# EAGLE board PCB_KioskMB_r3.2 (EAGLE 8.2.1), part 1 of 3
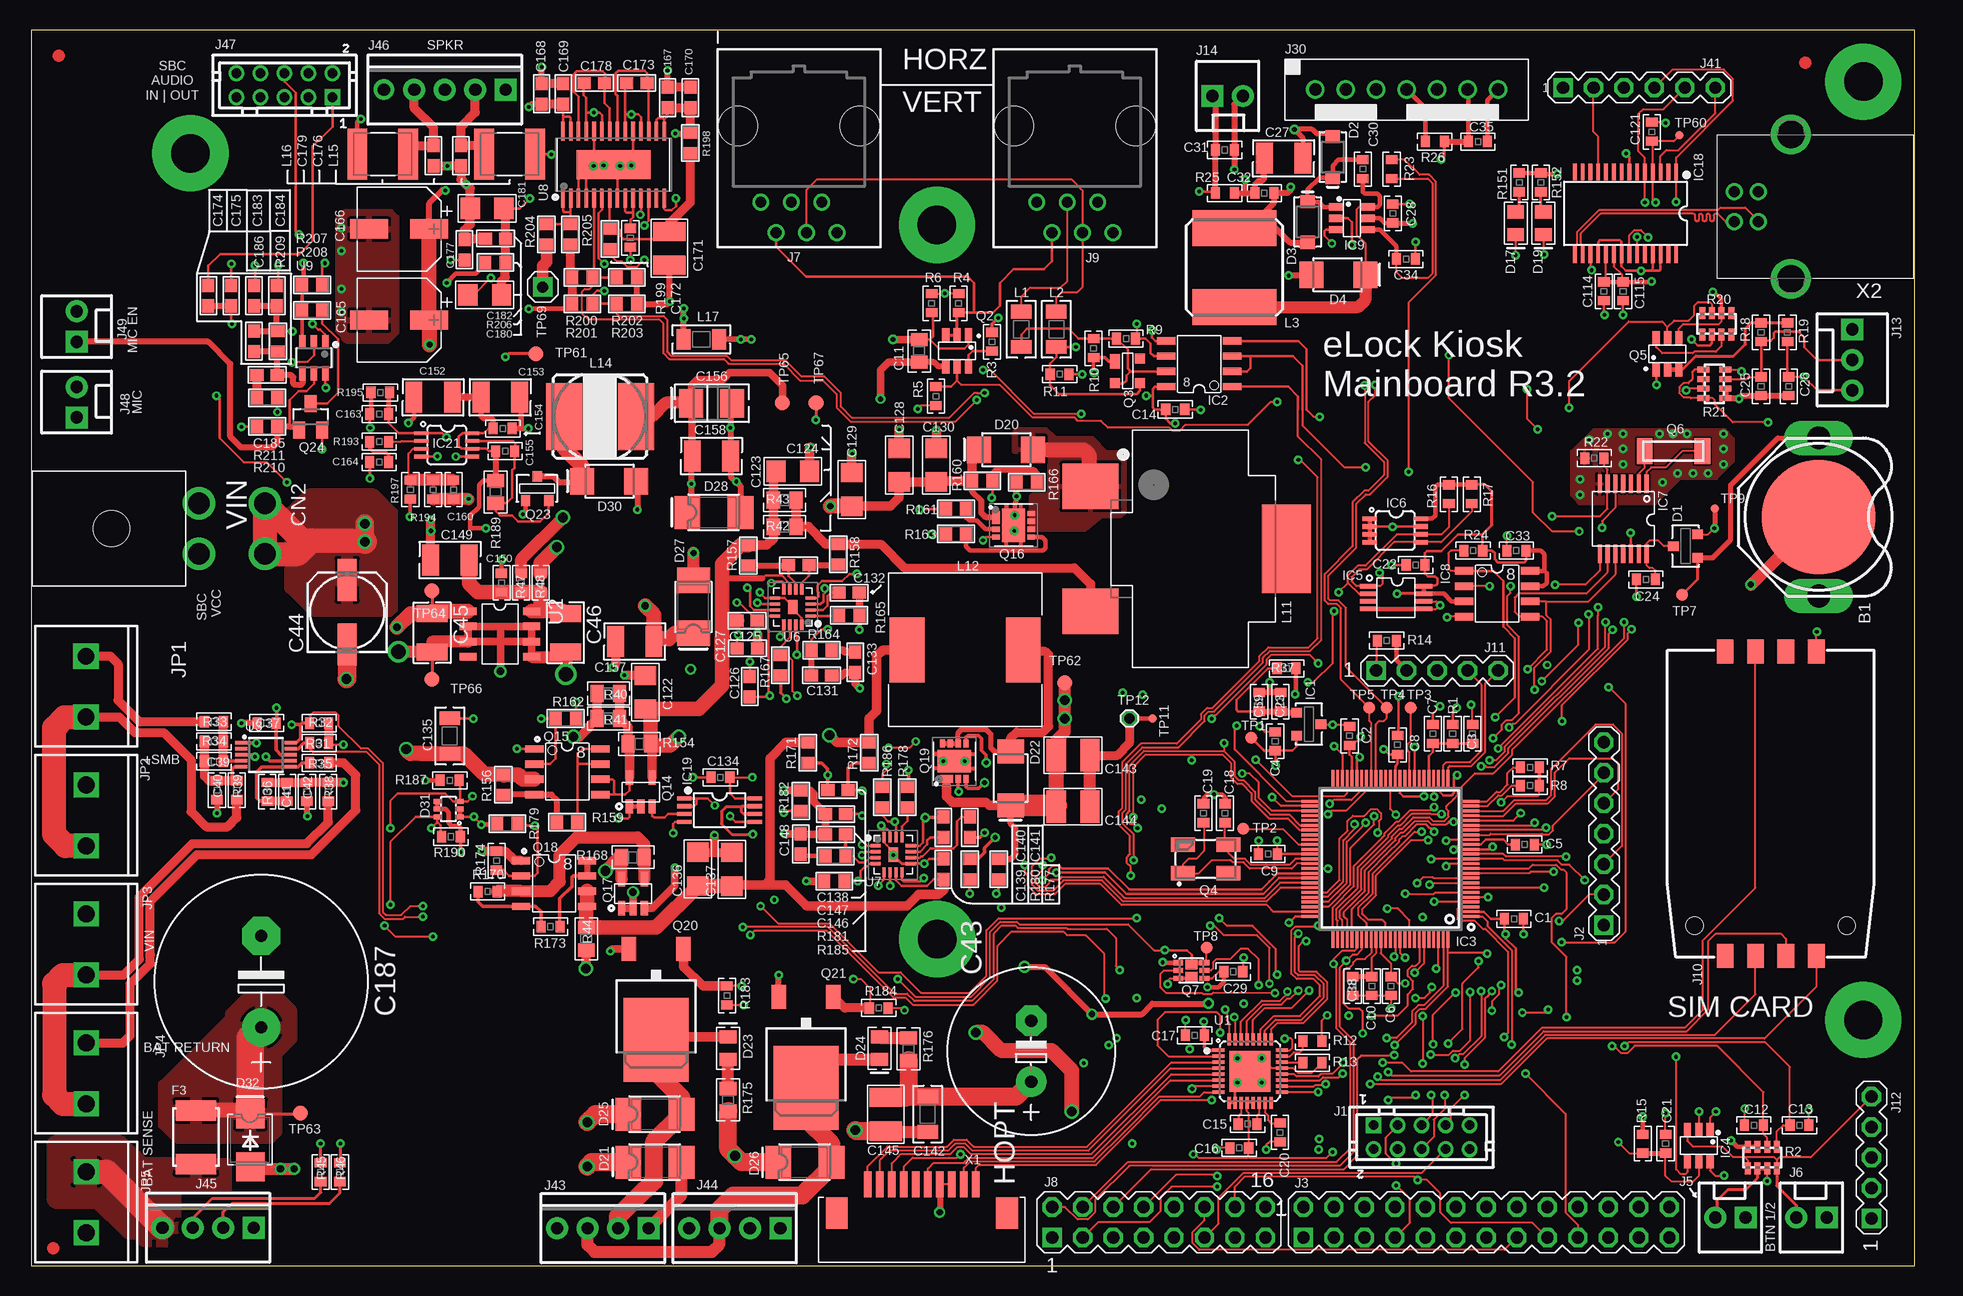
[diagram p11: board, top side]
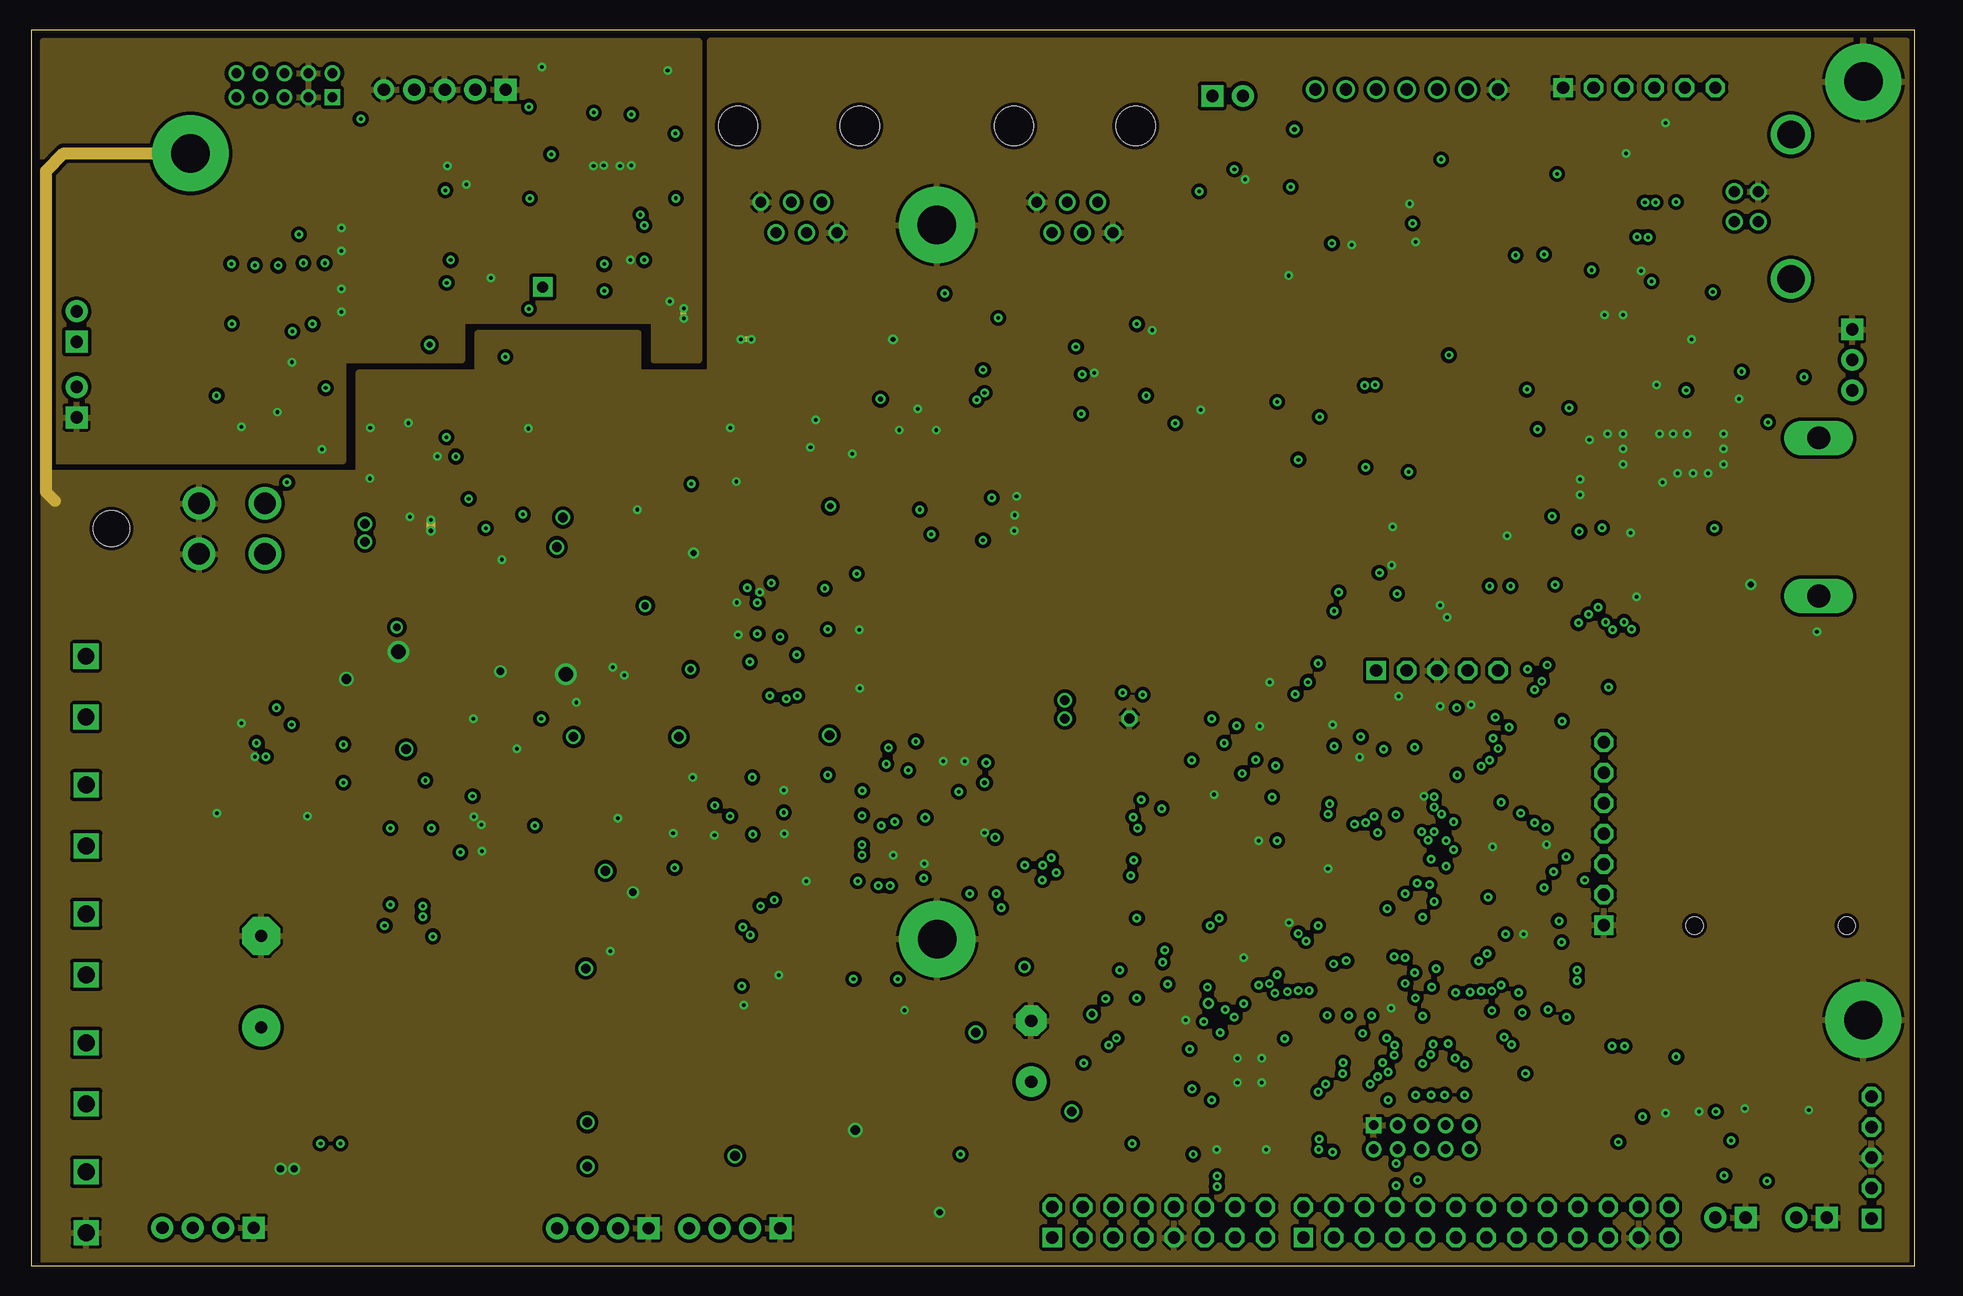
[diagram p12: board, inner layer DGND]
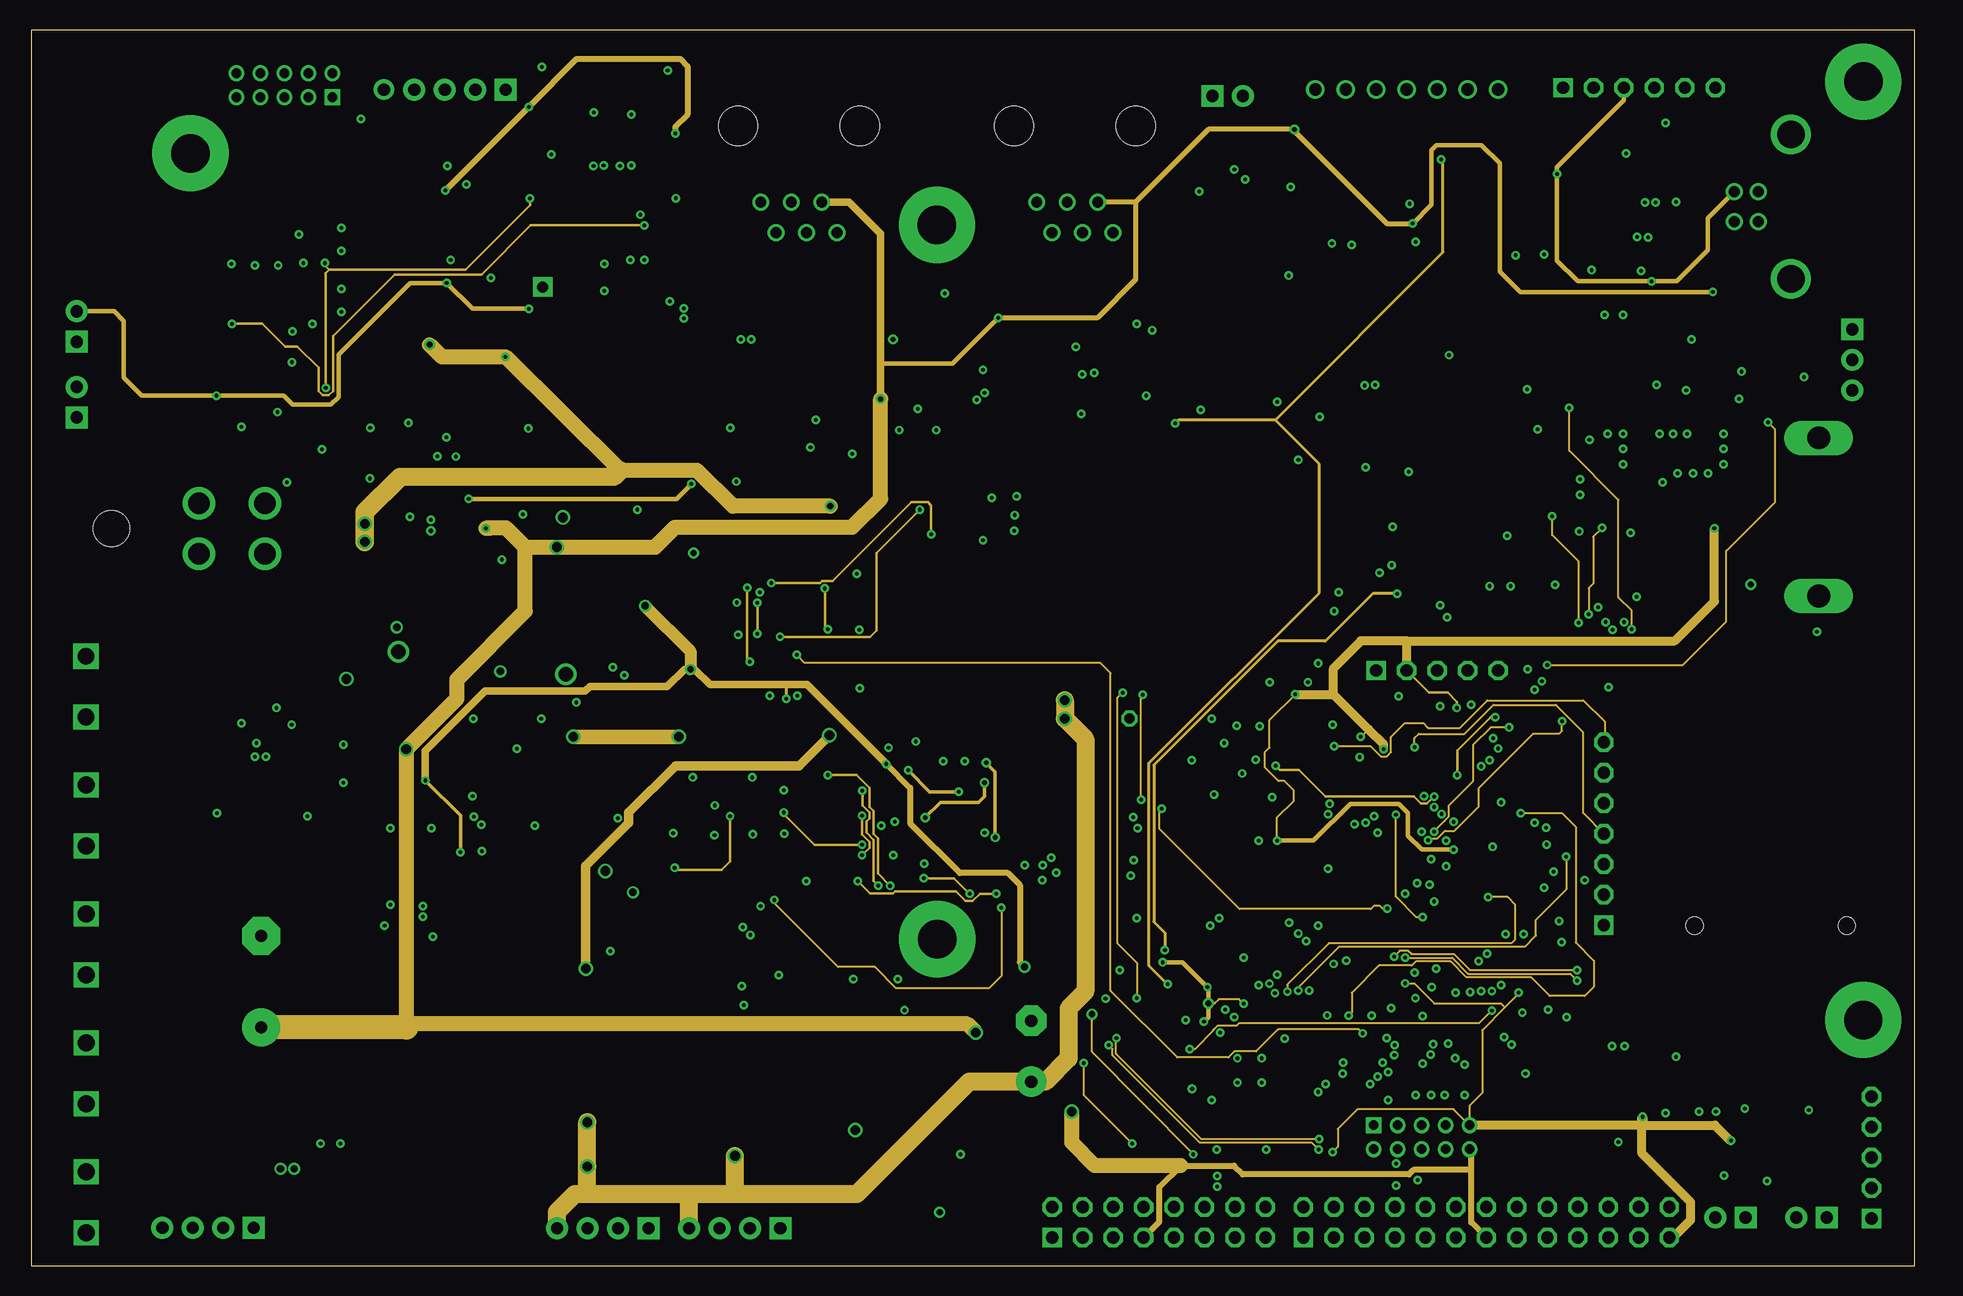
[diagram p13: board, inner layer SUPPLY]
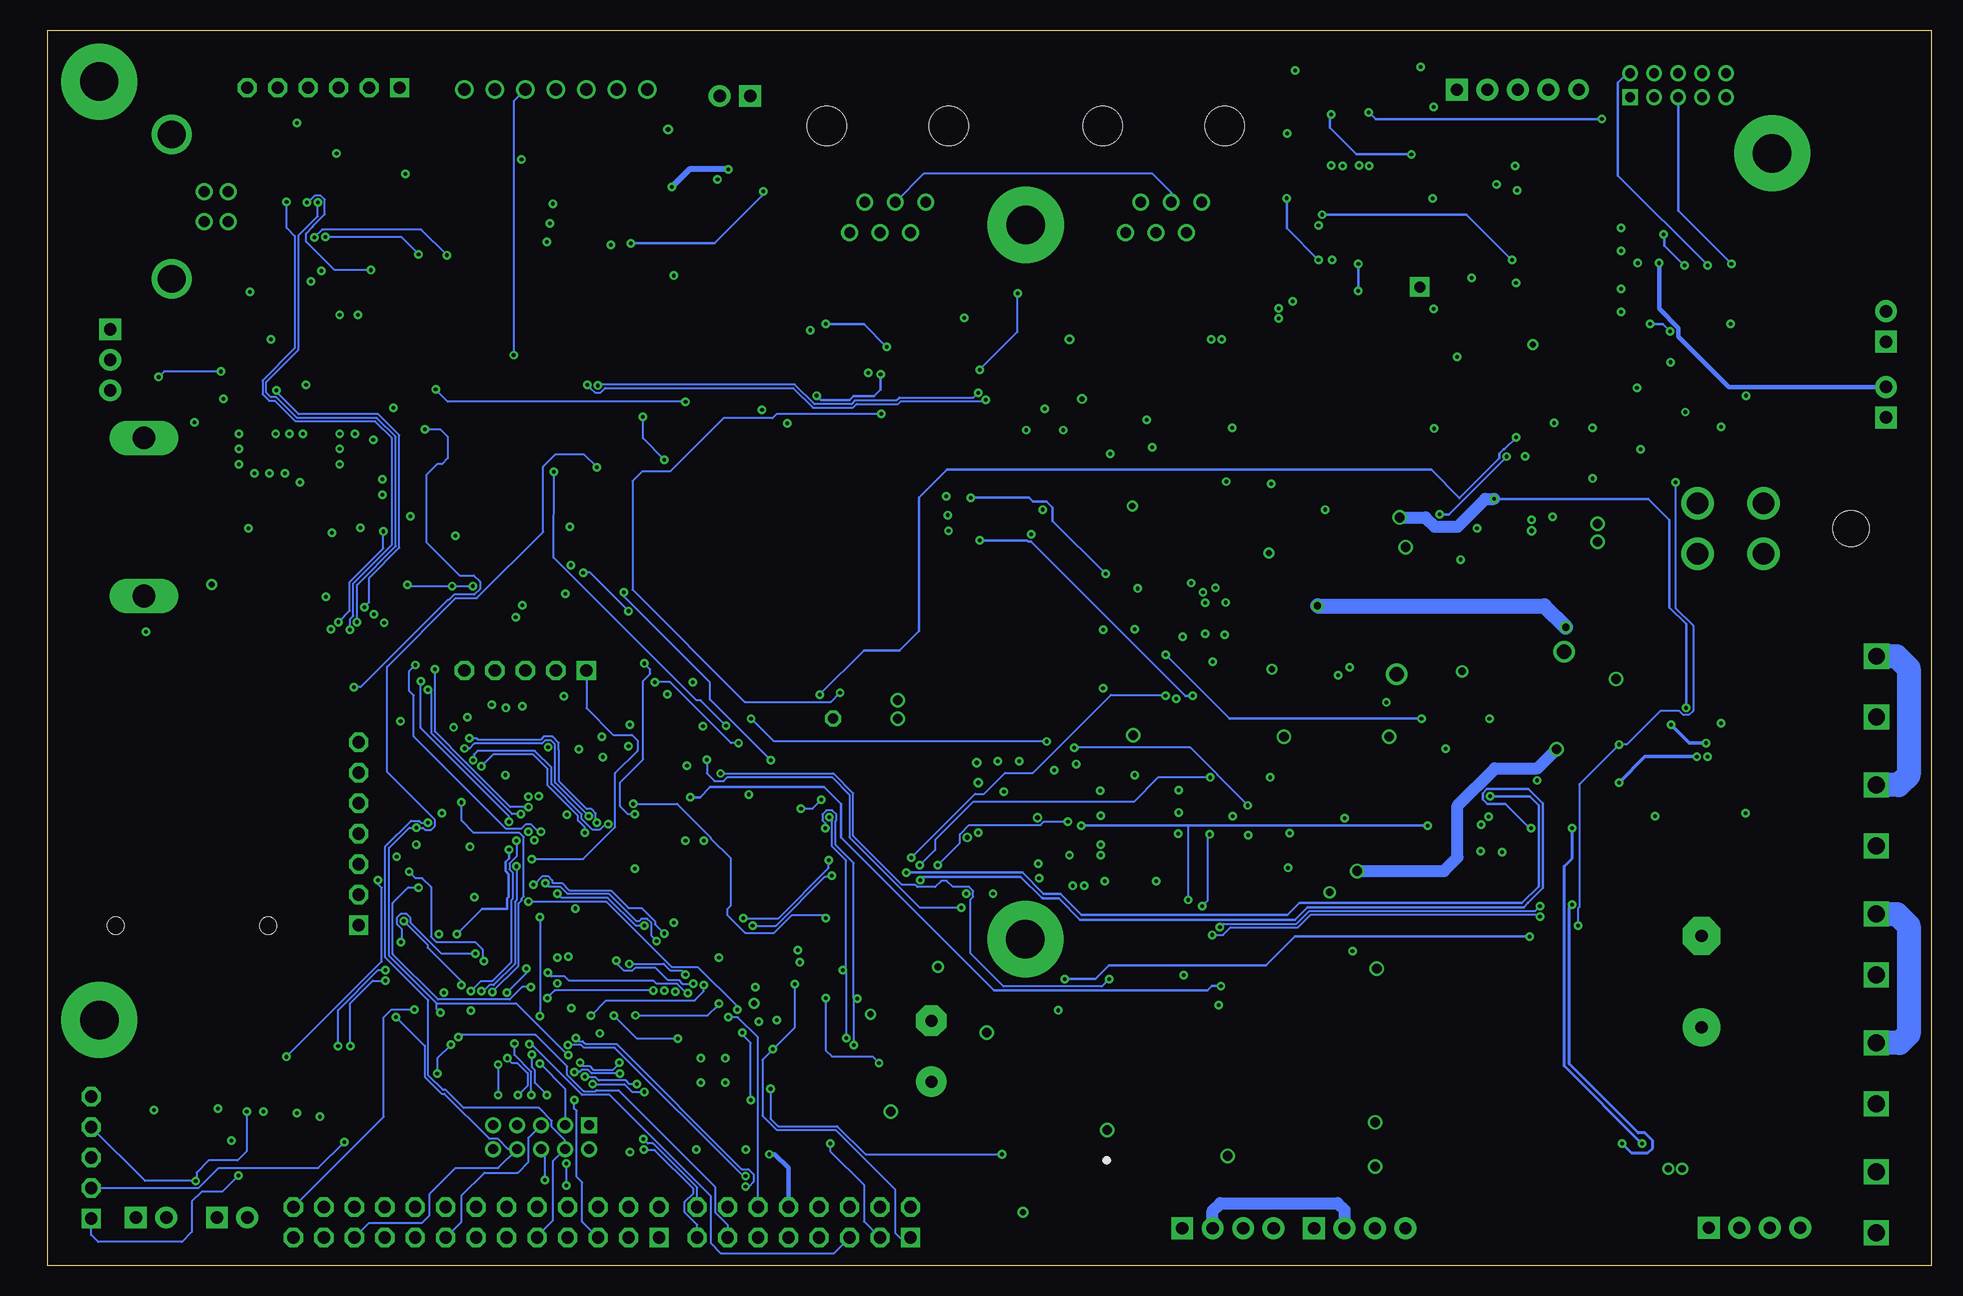
[diagram p14: board, bottom side, seen from below]

Size 157 x 103 mm. Coordinates in mm from the lower left corner, seen from the top.
Outline: 157,103 0,103 0,0 157,0 157,103
Copper layers (1*2*15*16): Top 0.035mm / dielectric 0.33mm / DGND 0.035mm / dielectric 0.8mm / SUPPLY 0.035mm / dielectric 0.33mm / Bottom 0.035mm
Design rules "alleybeachdrc4layer *": minimum track width 6mil, minimum drill 0.3mm, track to track 6mil, track to pad 6mil, pad to pad 6mil, via to via 6mil, smd to smd 6mil, copper to edge 10mil, drill to drill 10mil, minimum pad ring 10mil, minimum via ring 8mil, stop-mask expansion 5mil, vias tented up to drill 0.3mm, thermal gap 10mil

## Footprints (pad centres in the part's own frame; a part is rotated, then mirrored left to right if it is on the bottom)
3001 = drill 1.905 pad 2.413 long: + -6.6,0; +2 6.6,0 | smd 9.5 x 9.5: - 0,0
0603 = smd 0.762 x 0.965: 1 -0.787,0; 2 0.787,0
0805 = smd 1.092 x 1.397: 1 -0.94,0; 2 0.94,0
1210 = smd 1.397 x 2.591: 1 -1.6,0; 2 1.6,0
E5-13 = drill 1.016 pad 2.54: + -2.54,0 | drill 1.016 pad 2.54 octagon: - 2.54,0
153CLV-0605 = smd 3.5 x 1.6: + 2.7,0; - -2.7,0
C1206 = smd 1.6 x 1.8: 1 -1.4,0; 2 1.4,0
C0603 = smd 1.1 x 1: 1 -0.85,0; 2 0.85,0
1206 = smd 1.143 x 1.702: 1 -1.473,0; 2 1.473,0
C1210 = smd 1.6 x 2.7: 1 -1.4,0; 2 1.4,0
3528-POL = smd 2.007 x 2.388: 1 -1.702,0; 2 1.702,0
CAP_6.3MM_DIA_SMT = smd 1.6 x 3.2: 1 0,2.5; 2 0,-2.5
E7,5-18 = drill 1.016 pad 3.15: + -3.81,0 | drill 1.016 pad 3.15 octagon: - 3.81,0
0039301040 = drill 1.8: 1 -2.1,0; 2 2.1,0; 3 -2.1,5.5; 4 2.1,5.5 | hole 3: 0,-7.3
SOT-23 = smd 0.787 x 0.889: 1 0.991,1.016; 2 -0.94,1.016; 3 0.025,-1.016
SOD-123 = smd 1.1 x 1.2: A 1.7,0; C -1.7,0
SOD-128 = smd 2 x 2.2: A 2.2,0; K -2.3,0
0805-POL = smd 1.092 x 1.397: 1+ -0.94,0; 2 0.94,0
SMA = smd 2.159 x 2.743: + -2.311,0.003; - 2.108,-0.002
SMA' = smd 2.159 x 2.743: A 2.108,-0.002; C -2.311,0.003
SOT-363 = smd 0.42 x 0.6: 1 -0.65,-0.95; 2 0,-0.95; 3 0.65,-0.95; 4 0.65,0.95; 5 0,0.95; 6 -0.65,0.95
SMB = smd 2.4 x 2.4: A 2.2,0; C -2.2,0
1812 = smd 1.702 x 3.4: 1 -2.235,0; 2 2.235,0
STANDOFF-ELECTRICAL = drill 3.2 pad 6.35: P1 0,0
SO08 = smd 0.61 x 1.524: 1 -1.905,-2.743; 2 -0.635,-2.743; 3 0.635,-2.743; 4 1.905,-2.743; 5 1.905,2.743; 6 0.635,2.743; 7 -0.635,2.743; 8 -1.905,2.743
SQFP-S-12X12-100 = smd 0.24 x 1.6: 1 -4.8,-6.6; 2 -4.4,-6.6; 3 -4,-6.6; 4 -3.6,-6.6; 5 -3.2,-6.6; 6 -2.8,-6.6; 7 -2.4,-6.6; 8 -2,-6.6; 9 -1.6,-6.6; 10 -1.2,-6.6; 11 -0.8,-6.6; 12 -0.4,-6.6; 13 0,-6.6; 14 0.4,-6.6; 15 0.8,-6.6; 16 1.2,-6.6; 17 1.6,-6.6; 18 2,-6.6; 19 2.4,-6.6; 20 2.8,-6.6; 21 3.2,-6.6; 22 3.6,-6.6; 23 4,-6.6; 24 4.4,-6.6; 25 4.8,-6.6; 51 4.8,6.6; 52 4.4,6.6; 53 4,6.6; 54 3.6,6.6; 55 3.2,6.6; 56 2.8,6.6; 57 2.4,6.6; 58 2,6.6; 59 1.6,6.6; 60 1.2,6.6; 61 0.8,6.6; 62 0.4,6.6; 63 0,6.6; 64 -0.4,6.6; 65 -0.8,6.6; 66 -1.2,6.6; 67 -1.6,6.6; 68 -2,6.6; 69 -2.4,6.6; 70 -2.8,6.6; 71 -3.2,6.6; 72 -3.6,6.6; 73 -4,6.6; 74 -4.4,6.6; 75 -4.8,6.6 | smd 1.6 x 0.24: 26 6.6,-4.8; 27 6.6,-4.4; 28 6.6,-4; 29 6.6,-3.6; 30 6.6,-3.2; 31 6.6,-2.8; 32 6.6,-2.4; 33 6.6,-2; 34 6.6,-1.6; 35 6.6,-1.2; 36 6.6,-0.8; 37 6.6,-0.4; 38 6.6,0; 39 6.6,0.4; 40 6.6,0.8; 41 6.6,1.2; 42 6.6,1.6; 43 6.6,2; 44 6.6,2.4; 45 6.6,2.8; 46 6.6,3.2; 47 6.6,3.6; 48 6.6,4; 49 6.6,4.4; 50 6.6,4.8; 76 -6.6,4.8; 77 -6.6,4.4; 78 -6.6,4; 79 -6.6,3.6; 80 -6.6,3.2; 81 -6.6,2.8; 82 -6.6,2.4; 83 -6.6,2; 84 -6.6,1.6; 85 -6.6,1.2; 86 -6.6,0.8; 87 -6.6,0.4; 88 -6.6,0; 89 -6.6,-0.4; 90 -6.6,-0.8; 91 -6.6,-1.2; 92 -6.6,-1.6; 93 -6.6,-2; 94 -6.6,-2.4; 95 -6.6,-2.8; 96 -6.6,-3.2; 97 -6.6,-3.6; 98 -6.6,-4; 99 -6.6,-4.4; 100 -6.6,-4.8
SOT23-6 = smd 0.6 x 1.2: 1 -0.95,-1.306; 2 0,-1.306; 3 0.95,-1.306; 4 0.95,1.306; 5 0.003,1.306; 6 -0.95,1.306
TSSOP08-3 = smd 0.38 x 1.4: 1 -0.94,-2.343; 2 -0.305,-2.343; 3 0.33,-2.343; 4 0.965,-2.343; 5 0.965,2.292; 6 0.33,2.292; 7 -0.305,2.292; 8 -0.94,2.292
MSOP-08 = smd 0.38 x 1.2: 1 -1.008,-2.18; 2 -0.358,-2.18; 3 0.292,-2.18; 4 0.942,-2.18; 5 0.942,2.045; 6 0.292,2.045; 7 -0.358,2.045; 8 -1.008,2.045
TSSOP014 = smd 0.356 x 1.524: 1 -1.95,-2.873; 2 -1.305,-2.873; 3 -0.65,-2.873; 4 -0.005,-2.873; 5 0.65,-2.873; 6 1.295,-2.873; 7 1.95,-2.873; 8 1.95,2.962; 9 1.295,2.962; 10 0.65,2.962; 11 -0.005,2.962; 12 -0.65,2.962; 13 -1.305,2.962; 14 -1.95,2.962
SO-08 = smd 0.61 x 1.524: 1 -1.905,-2.743; 2 -0.635,-2.743; 3 0.635,-2.743; 4 1.905,-2.743; 5 1.905,2.743; 6 0.635,2.743; 7 -0.635,2.743; 8 -1.905,2.743
SSOP28DB = smd 0.32 x 1.4: 1 -4.225,-3.45; 2 -3.575,-3.45; 3 -2.925,-3.45; 4 -2.275,-3.45; 5 -1.625,-3.45; 6 -0.975,-3.45; 7 -0.325,-3.45; 8 0.325,-3.45; 9 0.975,-3.45; 10 1.625,-3.45; 11 2.275,-3.45; 12 2.925,-3.45; 13 3.575,-3.45; 14 4.225,-3.45; 15 4.225,3.45; 16 3.575,3.45; 17 2.925,3.45; 18 2.275,3.45; 19 1.625,3.45; 20 0.975,3.45; 21 0.325,3.45; 22 -0.325,3.45; 23 -0.975,3.45; 24 -1.625,3.45; 25 -2.275,3.45; 26 -2.925,3.45; 27 -3.575,3.45; 28 -4.225,3.45
TSSOP8 = smd 0.35 x 1.2: 1 -0.975,-2.925; 2 -0.325,-2.925; 3 0.325,-2.925; 4 0.975,-2.925; 5 0.975,2.925; 6 0.325,2.925; 7 -0.325,2.925; 8 -0.975,2.925
MSOP-08' = smd 0.3 x 1.2: 1 -1.008,-2.18; 2 -0.358,-2.18; 3 0.292,-2.18; 4 0.942,-2.18; 5 0.942,2.045; 6 0.292,2.045; 7 -0.358,2.045; 8 -1.008,2.045
DF11-10DP-2DSA = drill 0.813 pad 1.321 square: 1 4,-1 | drill 0.813 pad 1.321: 2 4,1; 3 2,-1; 4 2,1; 5 0,-1; 6 0,1; 7 -2,-1; 8 -2,1; 9 -4,-1; 10 -4,1
MA07-1 = drill 1.016 pad 1.6 square: 1 -7.62,0 | drill 1.016 pad 1.6 octagon: 2 -5.08,0; 3 -2.54,0; 4 0,0; 5 2.54,0; 6 5.08,0; 7 7.62,0
MA13-2 = drill 1.016 pad 1.6 square: 1 -15.24,-1.27 | drill 1.016 pad 1.6 octagon: 2 -15.24,1.27; 3 -12.7,-1.27; 4 -12.7,1.27; 5 -10.16,-1.27; 6 -10.16,1.27; 7 -7.62,-1.27; 8 -7.62,1.27; 9 -5.08,-1.27; 10 -5.08,1.27; 11 -2.54,-1.27; 12 -2.54,1.27; 13 0,-1.27; 14 0,1.27; 15 2.54,-1.27; 16 2.54,1.27; 17 5.08,-1.27; 18 5.08,1.27; 19 7.62,-1.27; 20 7.62,1.27; 21 10.16,-1.27; 22 10.16,1.27; 23 12.7,-1.27; 24 12.7,1.27; 25 15.24,-1.27; 26 15.24,1.27
3-641215-2 = drill 1.016 pad 1.829 square: 1 2.54,0 | drill 1.016 pad 1.829: 2 0,0
SS-6566-NF = drill 0.889: 1 -3.175,8.89; 2 -1.905,6.35; 3 -0.635,8.89; 4 0.635,6.35; 5 1.905,8.89; 6 3.175,6.35 | hole 3.251: 5.08,0; -5.08,0
MA08-2 = drill 1.016 pad 1.6 square: 1 -8.89,-1.27 | drill 1.016 pad 1.6 octagon: 2 -8.89,1.27; 3 -6.35,-1.27; 4 -6.35,1.27; 5 -3.81,-1.27; 6 -3.81,1.27; 7 -1.27,-1.27; 8 -1.27,1.27; 9 1.27,-1.27; 10 1.27,1.27; 11 3.81,-1.27; 12 3.81,1.27; 13 6.35,-1.27; 14 6.35,1.27; 15 8.89,-1.27; 16 8.89,1.27
CCM03-3504LFT-NR = smd 2 x 1.4: C1 12.7,3.81; C2 12.7,1.27; C3 12.7,-1.27; C4 12.7,-3.81; C5 -12.7,3.81; C6 -12.7,1.27; C7 -12.7,-1.27; C8 -12.7,-3.81 | hole 1.422: 10.16,6.35; 10.16,-6.35
MA05-1 = drill 1.016 pad 1.6 square: 1 -5.08,0 | drill 1.016 pad 1.6 octagon: 2 -2.54,0; 3 0,0; 4 2.54,0; 5 5.08,0
3-641215-3 = drill 1.016 pad 1.829 square: 1 2.54,0 | drill 1.016 pad 1.829: 2 0,0; 3 -2.54,0
HRXL-MAXSONAR-WRC-MB7387 = drill 1.016: 1 2.54,2.54; 2 5.08,2.54; 3 7.62,2.54; 4 10.16,2.54; 5 12.7,2.54; 6 15.24,2.54; 7 17.78,2.54
MA06-1 = drill 1.016 pad 1.6 square: 1 -6.35,0 | drill 1.016 pad 1.6 octagon: 2 -3.81,0; 3 -1.27,0; 4 1.27,0; 5 3.81,0; 6 6.35,0
3-641215-4 = drill 1.016 pad 1.829 square: 1 3.81,0 | drill 1.016 pad 1.829: 2 1.27,0; 3 -1.27,0; 4 -3.81,0
3-641215-5 = drill 1.016 pad 1.829 square: 1 5.08,0 | drill 1.016 pad 1.829: 2 2.54,0; 3 0,0; 4 -2.54,0 | drill 1.016 pad 1.702: 5 -5.08,0
1X02_2.54_SCREWTERM = drill 1.4 square: P1 5.08,0; P2 0,0
NRS8030 = smd 7 x 3: 1 0,-3.3; 2 0,3.3
L_SER20XX = smd 3.81 x 4.699: 1 -5.207,-8.319; 2 5.207,-8.319 | smd 7.366 x 4.064: 3 0,8.001
L_SRR1280 = smd 5.4 x 2.9: 1 0,4.85; 2 0,-4.85
CR75 = smd 5.6 x 3: 1 0,-3; 2 0,3
L1812 = smd 1.66 x 4.22: 1 -2.12,0; 2 2.12,0
SSOT-6 = smd 0.6 x 1.2: 1 -0.95,-1.306; 2 0,-1.306; 3 0.95,-1.306; 4 0.95,1.306; 5 0.003,1.306; 6 -0.95,1.306
SOT-143 = smd 1.194 x 0.838: 1 -0.813,-1.041 | smd 0.838 x 0.838: 2 0.991,-1.041; 3 0.991,1.041; 4 -1.016,1.041
7B = smd 2 x 1.2: 1 -1.9,-1.2; 2 1.9,-1.2; 3 1.9,1.2; 4 -1.9,1.2
CM519 = smd 1.3 x 2.2: 1 -2.4,0; 2 2.4,0
MICRO_FET = smd 0.42 x 0.8: 1 -0.65,-1.1; 2 0,-1.1; 3 0.65,-1.1; 4 0.65,1.1; 5 0,1.1; 6 -0.65,1.1 | smd 0.8 x 1: P1 -0.5,0; P2 0.5,0
SOT23-5 = smd 0.6 x 1.2: 1 -0.95,-1.206; 2 0,-1.206; 3 0.95,-1.206; 4 0.95,1.206; 5 -0.95,1.206
SON8_3.3X3.3_TI = smd 1.09 x 0.65: 1_2 -0.65,-1.475 | smd 0.44 x 0.65: 3 0.325,-1.475; 4 0.975,-1.475; 5 0.975,1.475; 6 0.325,1.475; 7 -0.325,1.475; 8 -0.975,1.475 | smd 2.8 x 1.9: EP 0,0
TO252 = smd 1.2 x 2: 1 -2.28,-4.8; 2 2.28,-4.8 | smd 5.4 x 7: 3 0,2.8
SOT23 = smd 1 x 1.4: 1 -0.95,-1.1; 2 0.95,-1.1; 3 0,1.1
0603-ARRAY = smd 0.5 x 1: 1 -1.2,-0.9; 2 -0.4,-0.9; 3 0.4,-0.9; 4 1.2,-0.9; 5 1.2,0.9; 6 0.4,0.9; 7 -0.4,0.9; 8 -1.2,0.9
0603-0RTOP = smd 0.762 x 0.965: 1 -0.787,0; 2 0.787,0
R0603 = smd 1 x 1.1: 1 -0.85,0; 2 0.85,0
SMD_ROUND_1MM = smd 1 x 1: P$1 0,0
SMD_ROUND_07MM = smd 0.7 x 0.7: P$1 0,0
TP_0.8_1.2 = drill 0.813 pad 1.219 octagon: 1 0,0
B1,27 = smd 1.27 x 1.27: TP 0,0
P1-13@1 = drill 0.914 pad 1.626 square: 1 0,0
LFCSP_5X5_032 = smd 1 x 0.3: 1 -2.65,1.75; 2 -2.65,1.25; 3 -2.65,0.75; 4 -2.65,0.25; 5 -2.65,-0.25; 6 -2.65,-0.75; 7 -2.65,-1.25; 8 -2.65,-1.75; 17 2.65,-1.75; 18 2.65,-1.25; 19 2.65,-0.75; 20 2.65,-0.25; 21 2.65,0.25; 22 2.65,0.75; 23 2.65,1.25; 24 2.65,1.75 | smd 0.3 x 1: 9 -1.75,-2.65; 10 -1.25,-2.65; 11 -0.75,-2.65; 12 -0.25,-2.65; 13 0.25,-2.65; 14 0.75,-2.65; 15 1.25,-2.65; 16 1.75,-2.65; 25 1.75,2.65; 26 1.25,2.65; 27 0.75,2.65; 28 0.25,2.65; 29 -0.25,2.65; 30 -0.75,2.65; 31 -1.25,2.65; 32 -1.75,2.65 | smd 3.4 x 3.4: PAD 0,0
LE33 = smd 0.635 x 1.4: 1 -1.905,-2.65; 2 -0.635,-2.65; 3 0.635,-2.65; 4 1.905,-2.65; 5 1.905,2.65; 6 0.635,2.65; 7 -0.635,2.65; 8 -1.905,2.65
MSOP10 = smd 0.3 x 1: 1 -1,-2.05; 2 -0.5,-2.05; 3 0,-2.05; 4 0.5,-2.05; 5 1,-2.05; 6 1,2.05; 7 0.5,2.05; 8 0,2.05; 9 -0.5,2.05; 10 -1,2.05
QFN16_3X3_EP = smd 0.85 x 0.28: 1 -1.475,0.75; 2 -1.475,0.25; 3 -1.475,-0.25; 4 -1.475,-0.75; 9 1.475,-0.75; 10 1.475,-0.25; 11 1.475,0.25; 12 1.475,0.75 | smd 0.28 x 0.85: 5 -0.75,-1.475; 6 -0.25,-1.475; 7 0.25,-1.475; 8 0.75,-1.475; 13 0.75,1.475; 14 0.25,1.475; 15 -0.25,1.475; 16 -0.75,1.475 | smd 0.8 x 1.2: EP 0,0
TSSOP28_EP = smd 1.6 x 0.3: 1 -2.8,4.225; 2 -2.8,3.575; 3 -2.8,2.925; 4 -2.8,2.275; 5 -2.8,1.625; 6 -2.8,0.975; 7 -2.8,0.325; 8 -2.8,-0.325; 9 -2.8,-0.975; 10 -2.8,-1.625; 11 -2.8,-2.275; 12 -2.8,-2.925; 13 -2.8,-3.575; 14 -2.8,-4.225; 15 2.8,-4.225; 16 2.8,-3.575; 17 2.8,-2.925; 18 2.8,-2.275; 19 2.8,-1.625; 20 2.8,-0.975; 21 2.8,-0.325; 22 2.8,0.325; 23 2.8,0.975; 24 2.8,1.625; 25 2.8,2.275; 26 2.8,2.925; 27 2.8,3.575; 28 2.8,4.225 | smd 2.4 x 6.17: EP 0,0
SOT23-6' = smd 0.55 x 1.2: 1 -0.95,-1.3; 2 0,-1.3; 3 0.95,-1.3; 4 0.95,1.3; 5 0,1.3; 6 -0.95,1.3
CON-FPC-1.0MM-10POS = smd 0.6 x 2.2: 1 -4.5,0; 2 -3.5,0; 3 -2.5,0; 4 -1.5,0; 5 -0.5,0; 6 0.5,0; 7 1.5,0; 8 2.5,0; 9 3.5,0; 10 4.5,0 | smd 1.8 x 2.6: P$1 -7.1,-2.4; P$2 7.1,-2.4
85-32004-10X = drill 0.92 pad 1.27: 1 4.71,-1.25; 2 4.71,1.25; 3 2.71,1.25; 4 2.71,-1.25 | drill 2.3 pad 3: M1 0,6.02; M2 0,-6.02

## Placement (x,y rotation side)
B1  3001/3.3V  [3001]  149,62.4 270 top
C1  1u/10V  [0603]  123.6,28.9 0 top
C2  0.1uF  [0603]  109.9,44.15 90 top
C3  10uF/4V  [0603]  120.14,44.32 90 top
C4  0.1uF  [0603]  103.7,43.7 90 top
C5  0.1uF  [0603]  124.5,35.1 0 top
C6  0.1uF  [0603]  113.35,23.3 270 top
C7  10uF/4V  [0603]  116.84,44.32 90 top
C8  1u/10V  [0603]  113.9,43.4 90 top
C9  10uF/4V  [0603]  103.1,34.3 180 top
C10  10uF/4V  [0603]  111.75,23.3 90 top
C11  4.7uF/16V  [0805]  74.03,76.25 90 top
C12  10nF  [0603]  143.6,11.7 180 top
C13  10nF  [0603]  147.4,11.7 0 top
C14  1u/6.3V  [0603]  95.36,71.37 0 top
C15  1u/10V  [0603]  101.4,11.8 0 top
C16  4.7uF/6.3V  [0603]  100.7,9.8 0 top
C17  0.1uF  [0603]  97,19.2 180 top
C18  18pF  [0603]  99.52,37.71 270 top
C19  18pF  [0603]  97.72,37.71 270 top
C20  4.7uF/6.3V  [0603]  104.1,11.1 90 top
C21  0.1uF  [0603]  136.24,10.16 90 top
C22  0.1uF  [0603]  115.4,58.4 180 top
C23  10uF/4V  [0603]  104.14,46.99 90 top
C24  1u/10V  [0603]  134.6,57.2 180 top
C25  10nF  [0603]  144.2,73.3 270 top
C26  10nF  [0603]  146.5,73.3 270 top
C27  22u/16V  [1210]  104.4,92.3 180 top
C28  1uF/16V  [0603]  113.5,87.7 90 top
C29  10uF/4V  [0603]  100.2,24.5 180 top
C30  0.1uF  [0603]  111,91.4 270 top
C31  1uF/16V  [0603]  99.5,93 180 top
C32  1uF/16V  [0603]  102.8,89.4 180 top
C33  0.1uF  [0603]  123.8,59.6 180 top
C34  dnp  [0603]  114.6,83.9 0 top
C35  0.1uF  [0603]  120.6,93.7 180 top
C37  0.1uF  [0603]  19.63,45.22 180 top
C38  10uF/4V  [0603]  110.15,23.3 90 top
C39  10uF/4V  [0603]  15.24,42.04 180 top
C40  0.1uF  [0603]  15.49,39.62 270 top
C41  10uF/4V  [0603]  21.34,39.5 90 top
C42  0.1uF  [0603]  22.99,39.5 270 top
C43  470uF/35-50V  [E5-13]  83.36,17.86 90 top
C44  220uF, 16V, AL  [153CLV-0605]  26.34,54.47 90 top
C45  10uF  [1210]  33.43,52.75 270 top
C46  0.1uF  [1210]  44.54,52.75 270 top
C59  10uF/4V  [0603]  102.36,46.99 90 top
C114  0.1u  [0603]  131.09,81.21 90 top
C115  4.7uF/6.3V  [0603]  132.69,81.21 90 top
C121  0.1u  [0603]  135.09,94.51 270 top
C122  22uF,25V,1206  [C1206]  51.19,47.79 90 top
C123  22uF,25V,1206  [C1206]  63.49,66.19 0 top
C124  100pF,C0G  [C0603]  63.99,58.39 0 top
C125  0.1uF  [C0603]  59.68,53.76 0 top
C126  0.1uF  [C0603]  59.9,48.25 270 top
C127  4.7uF/6.3V  [C0603]  59.7,51.45 180 top
C128  22uF,25V,1206  [C1206]  72.35,66.73 90 top
C129  22uF,25V,1206  [C1206]  68.39,64.7 90 top
C130  22uF,25V,1206  [C1206]  75.45,66.73 90 top
C131  130pF,C0G  [C0603]  65.89,49.19 0 top
C132  0.1uF  [C0603]  68.19,56.09 0 top
C133  15nF  [C0603]  68.69,50.29 270 top
C134  10nF  [0603]  57.45,40.69 180 top
C135  10uF/35V  [1206]  34.89,44.15 90 top
C136  22uF,25V,1206  [C1206]  55.58,33.06 90 top
C137  22uF,25V,1206  [C1206]  58.42,33.03 90 top
C138  100pF,C0G  [C0603]  67.25,39.64 0 top
C139  0.1uF  [C0603]  76.05,33.04 90 top
C140  0.1uF  [C0603]  76.05,36.54 90 top
C141  4.7uF/6.3V  [C0603]  78.25,36.54 270 top
C142  10uF/35V  [1206]  74.72,12.61 270 top
C143  10uF,50V,1210  [C1210]  86.85,42.54 0 top
C144  10uF,50V,1210  [C1210]  86.85,38.24 0 top
C145  10uF,50V,1210  [C1210]  71.22,12.61 270 top
C146  100pF  [C0603]  67.05,35.94 180 top
C147  0.1uF  [C0603]  67.05,37.64 180 top
C148  10nF  [C0603]  64.15,35.14 90 top
C149  22u/16V  [1210]  34.91,58.82 180 top
C150  0.1uF  [0603]  39.21,56.92 90 top
C152  22u/16V  [1210]  33.51,72.38 180 top
C153  22u/16V  [1210]  39.11,72.38 0 top
C154  0.1uF  [0603]  39.31,69.78 0 top
C155  1nF  [0603]  39.51,67.88 0 top
C156  TCJB157M006R0045  [3528-POL]  56.71,71.88 0 top
C157  47u/6.3V  [1210]  50.31,52.02 180 top
C158  47u/6.3V  [1210]  56.71,67.48 0 top
C160  15pF  [0603]  35.21,64.68 270 top
C163  0.1uF  [0603]  29.01,70.98 180 top
C164  330pF  [0603]  29.01,66.98 180 top
C165  220uF,16V,AL  [CAP_6.3MM_DIA_SMT]  30.68,78.82 270 top
C166  220uF,16V,AL  [CAP_6.3MM_DIA_SMT]  30.68,86.42 270 top
C167  0.1uF  [C0603]  53.05,97.37 90 top
C168  0.1uF  [C0603]  42.55,97.67 90 top
C169  1.0nF,50V  [C0603]  44.35,97.67 90 top
C170  1.0nF,50V  [C0603]  54.95,97.37 90 top
C171  10uF,50V,1210  [C1210]  53.21,84.8 270 top
C172  1uF,25V  [0603]  49.95,85.67 270 top
C173  0.47uF  [C0603]  50.48,98.57 180 top
C174  0.47uF  [C0603]  14.78,80.84 270 top
C175  0.47uF  [C0603]  16.68,80.84 270 top
C176  1.0nF,50V  [C0603]  35.83,92.52 270 top
C177  0.47uF  [C0603]  36.12,84.67 270 top
C178  0.47uF  [C0603]  46.95,98.57 180 top
C179  1.0nF,50V  [C0603]  33.53,92.52 270 top
C180  22uF,25V,1206  [C1206]  37.81,80.92 180 top
C181  22uF,25V,1206  [C1206]  38.01,88.12 180 top
C182  1uF,25V  [C0603]  38.71,85.62 180 top
C183  3.3uF,16V  [C0603]  18.58,80.84 90 top
C184  3.3uF,16V  [C0603]  20.48,80.84 90 top
C185  3.3uF,16V  [C0603]  19.68,74.24 180 top
C186  220pF  [C0603]  18.58,77.04 90 top
C187  2mF/16V  [E7,5-18]  19.17,23.66 90 top
CN2  0039301040  [0039301040]  14,61.43 270 top
D1  BAS70-05E6327  [SOT-23]  137.9,60 270 top
D2  DNP  [SOD-123]  108.5,92.4 90 top
D3  STPS0540Z  [SOD-123]  106.4,87 270 top
D4  PMEG3030BEP  [SOD-128]  108.9,82.6 180 top
D17  LED-GR  [0805-POL]  123.75,86.89 90 top
D19  LED-GR  [0805-POL]  126.05,86.89 90 top
D20  PMEG3030BEP  [SOD-128]  81.29,68.01 0 top
D21  SMAJ26A  [SMA]  52.09,8.61 0 top
D22  PMEG3030BEP  [SOD-128]  81.65,40.64 90 top
D23  LED-GR  [0805-POL]  58.09,18.11 270 top
D24  LED-GR  [0805-POL]  70.72,18.11 90 top
D25  SS14  [SMA']  52.09,12.61 0 top
D26  SS14  [SMA']  64.59,8.61 0 top
D27  SMLVT3V3  [SMA]  55.21,55.02 90 top
D28  SMAJ5.0A  [SMA]  57.01,62.78 0 top
D30  PMEG3030BEP  [SOD-128]  48.21,65.38 0 top
D31  BAT54BRW-7F  [SOT-363]  34.79,38.05 90 top
D32  P6SMB16A  [SMB]  18.27,10.44 270 top
DRILEGEND  [DRILEGEND]  -18.47,-15.09 0 top  (outside the outline)
F3  2920L250DR  [1812]  13.74,10.7 90 top
FID1  [REF]  1.86,1.45 0 top
FID2  [REF]  147.87,100.27 0 top
FID3  [REF]  2.3,100.83 0 top
H1  STANDOFF_ELECTRICAL  [STANDOFF-ELECTRICAL]  13.28,92.72 0 top
H2  STANDOFF_ELECTRICAL  [STANDOFF-ELECTRICAL]  75.53,27.21 0 top
H3  STANDOFF_ELECTRICAL  [STANDOFF-ELECTRICAL]  152.72,20.47 0 top
H4  STANDOFF_ELECTRICAL  [STANDOFF-ELECTRICAL]  152.73,98.69 0 top
H5  STANDOFF_ELECTRICAL  [STANDOFF-ELECTRICAL]  75.5,86.75 0 top
H6  STANDOFF_ELECTRICAL  [STANDOFF-ELECTRICAL]  -9.93,4.26 0 top  (outside the outline)
IC1  ISL60002DIH325Z-TK  [SOT-23]  106.5,45.1 90 top
IC2  SN65HVD12D  [SO08]  97.36,75.17 90 top
IC3  PIC24FJ256GA110-I/PT  [SQFP-S-12X12-100]  113.3,33.9 90 top
IC4  PIC10F200T-I/OT  [SOT23-6]  139,10 180 top
IC5  LM75ADP  [TSSOP08-3]  113.8,55.7 270 top
IC6  24LC32A-I/MS  [MSOP-08]  113.76,61.24 270 top
IC7  PCF2123TS/1-T  [TSSOP014]  132.7,62.3 180 top
IC8  M25P16-VMN6P  [SO-08]  122.2,56 270 top
IC9  LM3405AXMK/NOPB  [SOT23-6]  110.1,87.3 270 top
IC18  FT232RL  [SSOP28DB]  132.89,87.71 180 top
IC19  MCP6022-I/ST  [TSSOP8]  57.38,37.97 270 top
IC21  LTC1771EMS8  [MSOP-08']  34.71,68.38 270 top
J1  DF11-10DP-2DSA(01)  [DF11-10DP-2DSA]  115.9,10.7 180 top
J2  [MA07-1]  131.1,36 90 top
J3  [MA13-2]  121.3,3.6 0 top
J5  3-641215-2  [3-641215-2]  140.37,4 0 top
J6  3-641215-2  [3-641215-2]  147.13,4 0 top
J7  SS-6566-NF  [SS-6566-NF]  64,95 180 top
J8  TSW-108-07-G-D  [MA08-2]  94,3.6 0 top
J9  SS-6566-NF  [SS-6566-NF]  87,95 180 top
J10  CCM03-3504LFT-NR  [CCM03-3504LFT-NR]  145,38.5 270 top
J11  [MA05-1]  117.2,49.6 0 top
J12  [MA05-1]  153.4,9 90 top
J13  3-641215-3  [3-641215-3]  151.8,75.5 90 top
J14  3-641215-2  [3-641215-2]  101,97.5 180 top
J30  22-11-2072  [HRXL-MAXSONAR-WRC-MB7387]  104.5,95.5 0 top
J41  [MA06-1]  134.04,98.19 0 top
J43  3-641215-4  [3-641215-4]  47.65,3.11 0 top
J44  3-641215-4  [3-641215-4]  58.64,3.11 0 top
J45  3-641215-4  [3-641215-4]  14.75,3.16 0 top
J46  3-641215-5  [3-641215-5]  34.48,98.03 0 top
J47  DF11-10DP-2DSA(01)  [DF11-10DP-2DSA]  21.12,98.39 0 top
J48  3-641215-2  [3-641215-2]  3.79,73.24 270 top
J49  3-641215-2  [3-641215-2]  3.79,79.54 270 top
JP1  [1X02_2.54_SCREWTERM]  4.57,50.8 270 top
JP2  [1X02_2.54_SCREWTERM]  4.6,40.05 270 top
JP3  [1X02_2.54_SCREWTERM]  4.6,29.3 270 top
JP4  [1X02_2.54_SCREWTERM]  4.6,18.56 270 top
JP5  [1X02_2.54_SCREWTERM]  4.6,7.81 270 top
L1  HI1206T500R-00  [1206]  82.53,78.05 90 top
L2  HI1206T500R-00  [1206]  85.46,78.05 90 top
L3  NRS8030T150MJGJ  [NRS8030]  100.3,83.2 0 top
L11  SER2013-472MLD  [L_SER20XX]  96.62,59.74 270 top
L12  SRR1280-150M  [L_SRR1280]  77.85,51.32 270 top
L14  CR75NP-220KC  [CR75]  47.41,70.78 270 top
L15  HI1812V101R-10  [L1812]  39.88,92.65 0 top
L16  HI1812V101R-10  [L1812]  29.31,92.65 180 top
L17  HI1206T500R-00  [1206]  55.87,77.21 180 top
Q2  FDC6330L  [SSOT-6]  77.18,76.25 180 top
Q3  SR3.3.TCT  [SOT-143]  91.4,74.57 270 top
Q4  7B-28.63636MAAJ-T  [7B]  97.9,33.9 0 top
Q5  FDC6330L  [SSOT-6]  136.4,76 0 top
Q6  CM519 32.768KDZF-UT  [CM519]  136.9,67.9 0 top
Q7  SSM6P49NU,LFPZ  [MICRO_FET]  96.7,24.6 270 top
Q14  MAX9938HEUK  [SOT23-5]  50.82,39.47 0 top
Q15  SI4564DY  [SO-08]  44.69,41.16 270 top
Q16  CSD87331Q3D  [SON8_3.3X3.3_TI]  81.89,61.71 270 top
Q17  MAX9938HEUK  [SOT23-5]  50.16,30.99 0 top
Q18  SI4564DY  [SO-08]  43.59,31.85 270 top
Q19  CSD87331Q3D  [SON8_3.3X3.3_TI]  76.95,42.04 0 top
Q20  IPD30N06S2L-23  [TO252]  52.09,21.61 180 top
Q21  IPD30N06S2L-23  [TO252]  64.59,17.61 180 top
Q23  FDN352AP  [SOT-23]  42.21,64.78 180 top
Q24  BSS138  [SOT23]  23.3,70.75 0 top
R1  300R  [0603]  118.49,44.32 90 top
R2  100K  [0603-ARRAY]  144.3,9 0 top
R3  1M  [0603]  80.09,77.01 270 top
R4  1M  [0603]  77.31,80.22 270 top
R5  1M  [0603]  75.42,72.47 90 top
R6  1M  [0603]  75.06,80.22 90 top
R7  100K  [0603]  124.94,41.53 0 top
R8  3.57K  [0603]  124.94,40.01 0 top
R9  1M  [0603]  91.26,77.27 180 top
R10  1M  [0603]  88.56,76.47 90 top
R11  1M  [0603]  85.73,74.3 0 top
R12  470K  [0603-0RTOP]  106.8,18.7 0 top
R13  0R  [0603-0RTOP]  106.8,16.9 180 top
R14  33K  [0603]  113,52.1 0 top
R15  0R  [0603-0RTOP]  134.33,10.16 90 top
R16  10K  [0603-0RTOP]  118.18,64.3 90 top
R17  10K  [0603-0RTOP]  120.08,64.3 90 top
R18  649R  [0603]  144.2,77.8 270 top
R19  649R  [0603]  146.4,77.8 270 top
R20  100K  [0603-ARRAY]  140.5,78.5 0 top
R21  100K  [0603-ARRAY]  140.3,73.5 270 top
R22  1M  [0603]  130.3,67.3 0 top
R23  10K  [0603-0RTOP]  113.4,91.4 270 top
R24  1M  [0603]  120.2,59.6 180 top
R25  0.22R  [0603-0RTOP]  99.5,89.4 180 top
R26  10K  [0603-0RTOP]  117,93.7 0 top
R31  10K  [0603]  24,43.56 0 top
R32  10K  [0603]  24,45.21 0 top
R33  4.7K  [0603]  15.24,45.34 180 top
R34  1K  [0603]  15.24,43.69 0 top
R35  3k  [0603]  24,41.91 0 top
R36  1k  [0603]  19.68,39.5 270 top
R37  300R  [0603]  104.65,49.78 0 top
R38  1K  [0603]  24.77,39.5 270 top
R39  1K  [0603]  17.14,39.62 270 top
R40  0.025R  [0805]  48.13,47.7 180 top
R41  0.025R  [0805]  48.13,45.6 180 top
R42  0.025R  [0805]  62.81,61.58 0 top
R43  0.025R  [0805]  62.81,63.8 0 top
R44  0.025R  [0805]  46.28,27.24 270 top
R45  470R  [0603]  24.13,7.79 270 top
R46  470R  [0603]  25.74,7.79 270 top
R47  0R  [0603]  40.85,56.92 90 top
R48  DNP  [0603]  42.48,56.92 90 top
R151  470R  [0603]  124.05,90.29 90 top
R152  470R  [0603]  125.85,90.29 90 top
R154  0.025R  [0805]  50.69,43.48 0 top
R156  1M  [R0603]  39.37,40.09 90 top
R157  10  [R0603]  59.79,59.19 90 top
R158  10  [R0603]  67.29,59.29 90 top
R159  1M  [R0603]  44.67,36.96 180 top
R160  178k,1%  [R0603]  79.29,65.41 180 top
R161  0  [R0603]  77.09,63.08 180 top
R162  10k  [R0603]  44.56,45.6 180 top
R163  0  [R0603]  77.09,60.98 180 top
R164  5.90k,1%  [R0603]  65.89,51.29 180 top
R165  93.1k,1%  [R0603]  68.19,54.19 180 top
R166  20.0k,1%  [R0603]  82.99,65.31 0 top
R167  100k  [R0603]  62.45,50.04 270 top
R168  0.025R  [0805]  50.16,34.04 0 top
R170  1M  [0603]  38.05,31.18 180 top
R171  10  [R0603]  64.75,42.74 90 top
R172  10  [R0603]  69.85,42.74 90 top
R173  1M  [0603]  43.29,28.25 0 top
R174  1M  [0603]  38.79,33.75 90 top
R175  3.3K  [0805]  58.09,13.81 270 top
R176  3.3K  [0805]  73.14,18.05 270 top
R177  178k,1%  [R0603]  80.65,33.04 90 top
R178  0  [R0603]  73.05,39.04 270 top
R179  10k  [R0603]  39.69,36.85 0 top
R180  0  [R0603]  78.25,33.04 270 top
R181  5.90k,1%  [R0603]  67.05,34.14 0 top
R182  93.1k,1%  [R0603]  64.15,38.74 270 top
R183  1M  [0603]  57.99,22.51 270 top
R184  1M  [0603]  70.65,21.48 0 top
R185  20.0k,1%  [R0603]  66.95,32.04 0 top
R186  100k  [R0603]  70.95,39.04 90 top
R187  47K  [0603]  34.89,40.45 180 top
R189  0.047R  [0805]  38.71,64.48 90 top
R190  47K  [0603]  34.99,35.75 0 top
R193  10K  [0603]  29.01,68.68 0 top
R194  3.09M  [0603]  33.51,64.68 90 top
R195  1M  [0603]  29.11,72.78 180 top
R197  1M  [0603]  31.61,64.68 270 top
R198  10  [R0603]  54.95,93.57 90 top
R199  0R  [R0603]  48.25,85.57 90 top
R200  1M  [R0603]  45.95,82.37 0 top
R201  1M  [R0603]  45.95,80.17 0 top
R202  DNP  [R0603]  49.65,82.37 0 top
R203  DNP  [R0603]  49.65,80.17 0 top
R204  1k  [R0603]  42.95,85.97 270 top
R205  100k  [R0603]  44.95,85.97 270 top
R206  33  [R0603]  38.71,83.62 180 top
R207  3.3k  [R0603]  23.42,81.74 180 top
R208  6.8k  [R0603]  23.42,79.64 0 top
R209  120k  [R0603]  20.58,77.04 270 top
R210  1M  [R0603]  19.68,69.94 180 top
R211  3.9k  [R0603]  19.68,72.34 0 top
TP1  [SMD_ROUND_1MM]  101.7,44 0 top
TP2  [SMD_ROUND_1MM]  101.05,36.42 0 top
TP3  [SMD_ROUND_1MM]  115,46.5 0 top
TP4  [SMD_ROUND_1MM]  113,46.48 0 top
TP5  [SMD_ROUND_1MM]  111.54,46.48 0 top
TP7  [SMD_ROUND_1MM]  137.6,55.9 0 top
TP8  [SMD_ROUND_1MM]  97.98,26.48 180 top
TP9  [SMD_ROUND_07MM]  140.33,63.09 90 top
TP11  [SMD_ROUND_07MM]  93.45,45.6 90 top
TP12  TP_0812  [TP_0.8_1.2]  91.55,45.6 0 top
TP60  [SMD_ROUND_07MM]  137.39,94.21 270 top
TP61  TPB1,27  [B1,27]  42.08,76.01 0 top
TP62  TPB1,27  [B1,27]  86.17,48.59 0 top
TP63  TPB1,27  [B1,27]  22.43,12.69 0 top
TP64  TPB1,27  [B1,27]  33.4,56.26 0 top
TP65  TPB1,27  [B1,27]  62.63,71.91 0 top
TP66  TPB1,27  [B1,27]  33.4,48.9 0 top
TP67  TPB1,27  [B1,27]  65.43,71.91 0 top
TP69  [P1-13@1]  42.65,81.57 0 top
U1  LTC1955  [LFCSP_5X5_032]  101.6,16.2 0 top
U2  LE33  [LE33]  39.07,52.64 270 top
U3  ADS1015  [MSOP10]  19.58,42.57 270 top
U6  TPS43061  [QFN16_3X3_EP]  63.49,54.89 180 top
U7  TPS43061  [QFN16_3X3_EP]  71.85,34.24 0 top
U8  TPA3111D1PWP  [TSSOP28_EP]  48.55,91.77 90 top
U9  OPA322SAIDBVT  [SOT23-6']  23.58,75.68 180 top
X1  FH12-10S-0.5S1.00MM  [CON-FPC-1.0MM-10POS]  74.24,6.77 0 top
X2  MINI-USB_4P-85-32004-10X  [85-32004-10X]  146.69,88.27 180 top

## Tracks (layer width: path | path; a pad name or v marks a point on that pad's centre or on a via)
3V3_AUD  (via drill 0.3)
  Top 0.203: U9.6 24.53,73.18 v24.55,73.15 | C181.1 40.74,88.12 v41.57,88.95 | R207.1 24.27,83.36 v24.48,83.57
  Top 0.762: C180.1 39.21,82.06 39.52,82.37 39.52,83.58 R206.1 C182.1 39.56,87.97 C181.1
  SUPPLY 0.203: v24.55,73.15 24.55,82.73 24.83,83.01 | 24.83,83.01 36.21,83.01 41.6,88.39 41.6,88.92 v41.57,88.95 | v24.48,83.57 24.48,83.36 24.83,83.01
5V_ON  (via drill 0.3)
  Top 0.152: IC3.92 114.9,28.78 113.91,29.77 v113.05,29.77
  Top 0.203: C163.1 29.8,70.25 30.65,69.39 IC21.1 34.26,69.39 v34.61,69.04
  Top 0.356: R195.1 29.8,72.68 C163.1
  SUPPLY 0.152: v113.05,29.77 112.65,29.77 112.42,30 111.94,30 111.67,29.72 100.73,29.72 94.05,36.4 94.05,37.92 v94.23,38.1 | v92.53,38.84 92.53,47.45 v92.66,47.59
  Bottom 0.152: v94.23,38.1 93.26,38.1 v92.53,38.84
  Bottom 0.203: v34.61,69.04 35.61,68.04 35.65,68.04 36.01,67.69 36.01,67.33 39.35,63.99 41.7,66.34 82.06,66.34 84.4,64.01 84.4,52.91 86.02,51.28 88.97,51.28 v92.66,47.59
18V_GND
  Top 0.305: U3.5 16.94,41.57 16.76,41.4 16.76,40.54 16.64,40.41
  Top 0.762: R39.1 16.64,40.41 C40.1 14.83,40.41 14.45,40.79 C39.2 R34.1
18V_SENSE
  Top 0.762: JP1.P2 6.6,50.8 7.24,50.16 7.24,47.12 9.02,45.34 R33.2
  Bottom 2: JP1.P2 2.92,50.8 1.91,49.78 1.91,40.89 2.75,40.05 JP2.P2
+3.3V  (via drill 0.3, 0.51, 0.61)
  Top 0.152: IC3.86 112.5,26.02 113.35,25.17 C6.1 113.92,23.52 v114.55,23.52 | U1.13 U1.12 101.31,13.51 101.31,12.89 101.49,12.72 C16.2 101.49,9.06 | C9.1 103.89,35.4 v103.85,35.43 | 101.49,9.06 101.36,8.94 97.33,8.94 97,9.27 v96.87,9.27 | v108.48,9.47 107.94,8.94 101.61,8.94 101.49,9.06 | R12.2 107.59,20.42 v108.02,20.85 | D1.2 139.77,60.94 v140.3,61.47
  Top 0.203: R186.2 70.95,40.98 71.29,41.33 v71.29,41.81 | C5.1 123.11,35.1 122.7,35.51 121.25,35.51 120.84,35.1 IC3.16 118.99,35.1 v118.56,34.67 | C1.1 122.81,27.73 v122.9,27.64 122.9,27.26 123.74,26.43 123.74,23.01 v124,22.76 | C8.1 113.18,42.61 v112.74,43.05 | C2.1 110.13,43.36 v110.84,44.07 | R1.2 118.49,46.13 v118.84,46.48
  Top 0.229: IC3.2 121.09,29.5 121.69,28.9 C1.1 | IC3.62 C9.1 | IC3.46 110.1,42.39 109.9,42.59 C2.1 | IC3.37 113.7,41.6 113.9,41.8 C8.1 | Q7.4 98.44,23.95 99,24.5 C29.2
  Top 0.254: R167.2 62.45,47.75 v62.96,47.24 | TP64.TP 33.43,56.26 33.43,54.55
  Top 0.279: U1.1 98.03,17.95 97.79,18.19 C17.1
  Top 0.305: R190.2 v35.78,34.44
  Top 0.356: R14.2 113.79,50.47 J11.2 | R2.7 R2.8 142.21,9.9 v141.7,10.41 | R15.2 v134.33,12.4 | D31.4 D31.5 34.54,38.05 34.82,37.77 34.82,36.91 35.07,36.65 35.63,36.65 35.78,36.5 R190.2 | v32.86,40.44 32.87,40.45 R187.2 | C17.1 97.76,19.23 v97.76,20.32 | v94.33,25.27 94.35,25.25 Q7.1 | C29.2 99.41,23.63 98.99,23.2 v98.05,23.2 | R37.2 105.44,47.68 v105.38,47.62
  Top 0.406: TP9.P$1 140.33,61.49 v140.3,61.47
  Top 0.508: v98.14,21.84 98.11,21.82 93.44,21.82 92.58,20.95 v88.44,20.95 84.5,24.89 v82.8,24.89
  Top 1.27: D27.+ 53.64,52.71 53.18,52.25 52.14,52.25 C157.1 51.91,54.26 v51.18,54.99 | U2.1 33.43,54.55 C45.1 31.62,54.35 v30.48,53.21
  SUPPLY 0.152: v103.85,35.43 103.85,37.34 105.25,38.73 105.25,39.62 104.49,40.39 103.98,40.39 102.84,41.53 102.84,42.8 103.22,43.18 103.22,45.47 v105.38,47.62 | v114.55,23.52 115.28,23.52 116.96,21.84 122.52,21.84 122.84,21.52 | 122.84,21.52 120.95,19.62 120.95,14.38 119.9,13.33 J1.9 118.57,13.03 110.56,13.03 108.91,11.38 108.91,9.88 108.5,9.47 v108.48,9.47 | v96.87,9.27 88.44,17.83 v88.44,20.95 | v101.06,21.82 100.68,22.2 99,22.2 98.65,21.84 v98.14,21.84 | 122.84,21.52 124,22.67 v124,22.76
  SUPPLY 0.203: v110.84,44.07 111.47,44.7 | v118.84,46.48 118.84,46.99 118.08,47.75 116.51,47.75 J11.2
  SUPPLY 0.254: v62.96,47.24 62.96,48.44
  SUPPLY 0.305: v35.78,34.44 35.78,37.52 v32.86,40.44
  SUPPLY 0.356: v97.76,20.32 98.14,20.7 v98.14,21.84 98.14,23.11 v98.05,23.2 95.98,25.27 v94.33,25.27 | v118.56,34.67 115.92,34.67 114.78,35.81 114.78,37.72 114.01,38.48 109.95,38.48 106.9,35.43 v103.85,35.43
  SUPPLY 0.508: v71.29,41.81 73.27,39.83 73.27,36.85 77.41,32.72 81.42,32.72 82.42,31.72 82.42,25.27 v82.8,24.89
  SUPPLY 0.61: v71.29,41.81 64.66,48.44 62.96,48.44 56.58,48.44 55.31,49.71 v54.96,49.71 54.45,49.71 53.03,48.28 46.58,48.28 46.17,47.88 37.85,47.88 32.86,42.89 v32.86,40.44
  SUPPLY 0.762: 134.33,11.68 J1.9 | 134.33,11.68 v134.33,12.4 134.27,12.34 134.27,9.34 138.33,5.27 138.33,3.81 136.85,2.33 J3.25 | 134.33,11.68 140.35,11.7 141.64,10.41 v141.7,10.41 | v112.74,43.05 112.74,43.43 111.47,44.7 108.55,47.62 | v105.38,47.62 108.55,47.62 | 108.55,47.62 108.55,49.78 110.84,52.07 114.65,52.07 | 114.65,52.07 137,52.07 140.3,55.37 v140.3,61.47 | J11.2 114.66,52.06 114.65,52.07
  SUPPLY 1.016: v51.18,54.99 54.96,51.21 v54.96,49.71
  Bottom 0.152: v108.02,20.85 102,20.85 101.16,21.69 101.16,21.72 v101.06,21.82
  Bottom 0.203: v118.56,34.67 118.56,33.95 118.86,33.65 118.86,32.9 118.58,32.62 118.58,30.72 118.71,30.59 118.71,29.72 120.82,29.72 v122.9,27.64
  Bottom 0.356: v96.87,9.27 96.41,9.27 95.27,8.13 J8.10
  Bottom 1.27: v51.18,54.99 32.26,54.99 v30.48,53.21
+3.3V/1  (via drill 0.3)
  Top 0.152: Q7.6 97.98,25.43 TP8.P$1 | v72.23,23.88 73.71,22.4 78.33,22.4 79.93,24 79.93,27.81 80.77,28.65 82.17,28.65 82.37,28.45 91.44,28.45 93.6,26.29 v94.51,26.29 | 17.7,66.98 19.64,66.98 v21.34,65.28 | v29.46,28.32 30.35,27.43 v33.49,27.43 | R31.2 24.92,43.43 v26.04,43.43
  Top 0.203: IC5.8 116.12,56.67 117.06,56.67 117.21,56.82 117.21,57.25 117.01,57.45 116.43,57.45 116.19,57.69 C22.1 116.19,59.4 116.35,59.56 117.57,59.56 118.94,60.94 120.95,60.94 120.99,60.89 R24.1 121.77,59.6 121.99,59.38 121.99,58.88 122.24,58.62 124.45,58.62 124.63,58.8 124.63,59.56 C33.1 | Q7.P1 96.74,25.14 96.74,25.91 96.36,26.29 v94.51,26.29 | v15.46,72.52 15.71,72.26 15.71,68.96 17.7,66.98
  Top 0.254: IC5.7 v113.86,56.01 | 120.95,60.94 121.76,61.75 121.76,64.52 121.19,65.08 R17.2
  Top 0.356: Q7.6 96.85,25.25 Q7.P1 | IC8.7 126.07,56.63 126.33,56.9 126.33,57.72 126.14,57.91 | 126.14,57.91 IC8.8 | C33.1 125.85,59.6 126.14,59.31 126.14,57.91 | IC8.3 118.4,55.37 117.76,56.01 IC5.7 IC5.8 | R17.2 R16.2 117.25,65.08 117.04,64.87 117.04,62.53 116.75,62.25 IC6.8 | R206.2 37.86,83.48 37.05,82.68 35.4,82.68 v34.64,81.92 | R201.1 44.69,79.76 v41.5,79.76
  Top 0.762: R201.1 R200.1 44.95,82.52 R205.2 | R32.2 R31.2
  SUPPLY 0.254: v113.86,56.01 111.83,56.01 107.87,52.05 103.92,52.05 93.59,41.72 93.59,28.65 94.51,27.74 v94.51,26.29
  SUPPLY 0.356: J49.2 6.91,79.54 7.71,78.74 7.71,74.04 9.24,72.52 v15.46,72.52 21.05,72.52 21.81,71.75 24.99,71.75 25.62,72.39 25.62,75.95 31.59,81.92 v34.64,81.92 36.8,79.76 v41.5,79.76
  Bottom 0.152: v21.34,65.28 21.34,54.82 19.86,53.35 19.86,46.24 20.21,45.9 20.69,45.9 21.02,46.23 22.61,46.23 25.4,43.43 v26.04,43.43 29.36,40.11 29.36,29.86 29.46,29.75 v29.46,28.32
  Bottom 0.203: v72.23,23.88 69.69,23.88 68.55,25.02 55.47,25.02 53.05,27.43 v33.49,27.43
+3.3V/2  (via drill 0.3)
  Top 0.152: Q7.3 94.94,23.95 94.73,23.75 v94.73,23.44 | J2.2 129.87,30.92 127.68,28.73 v127.35,28.73 | v122.52,23.37 122.34,23.19 122.34,22.62 121.76,22.04 v121.76,21.26
  Top 0.203: IC2.8 93.68,73.27 93.49,73.08 93.49,72.52 | 93.49,72.52 93.49,71.5 93.64,71.35 94.56,71.35 C14.1 94.58,70.59 | R11.2 87.59,74.3 v87.6,74.3 | v92.93,72.52 93.49,72.52
  Top 0.254: v95.37,70.21 94.96,70.21 94.58,70.59 | v117.52,92.2 117.79,92.47 R26.2
  Top 0.305: Q7.3 96.55,23.95 Q7.P2
  Top 0.356: C35.2 119.81,97.97 J30.6
  Top 0.508: R26.2 C35.2
  SUPPLY 0.152: v121.76,21.26 120.69,20.19 100.68,20.19 100.48,19.99 98.89,19.99 98.55,19.65 98.55,19.59 96.99,18.03 v96.56,18.03
  SUPPLY 0.254: v94.73,23.44 93.19,24.99 93.19,41.88 107.38,56.08 107.38,66.8 103.7,70.48 | 103.7,70.48 95.65,70.48 v95.37,70.21 | 103.7,70.48 117.7,84.48 117.7,92.1 117.59,92.2 v117.52,92.2
  Bottom 0.152: v94.73,23.44 94.73,19.86 v96.56,18.03 97.45,17.14 97.45,12.5 96.26,11.3 91.33,11.3 86.38,6.35 86.38,2.72 85.99,2.33 J8.1 | v127.35,28.73 125.37,26.75 125.37,26.52 122.52,23.67 v122.52,23.37
  Bottom 0.203: v87.6,74.3 87.6,73.03 88.16,72.47 89.84,72.47 90.17,72.14 90.26,72.14 92.55,72.14 v92.93,72.52
+5V  (via drill 0.3, 0.8)
  Top 0.305: U3.8 20.8,42.57 20.41,42.96 C37.1 20.45,45.26 v20.45,46.48
  Top 0.356: 36.45,63.9 v36.47,63.91
  Top 0.508: D28.+ 55.03,63.12 v55.03,65.15 55.03,67.41 C158.1
  Top 0.61: C158.1 55.11,71.78 C156.1 55.03,71.91 55.03,73.41 55.49,73.86 57.68,73.86 58.23,74.42 61.56,74.42 62.63,73.36 TP65.TP
  Top 1.016: C156.1 54.96,71.93 52.9,71.93 51.75,70.78 L14.2 | R47.2 40.85,58.88 v44.32,62.36 | 36.45,63.9 C160.2 R194.1
  SUPPLY 0.356: v36.47,63.91 53.79,63.91 v55.03,65.15
  Bottom 0.203: v36.47,63.91 35.43,63.91 33.66,63.91 27.07,63.91 27.05,63.89 23.61,63.89 21.84,62.13 21.84,54.86 20.45,53.47 v20.45,46.48
  Bottom 1.016: v44.32,62.36 42.17,62.36 41.41,61.6 39.49,61.6 37.19,63.91 v36.47,63.91
+SMB  (via drill 0.3, 0.4, 0.8)
  Top 0.152: Q5.4 137.35,78.12 137.71,78.49 140.68,78.49 140.91,78.72 140.91,79.39 R20.6
  Top 0.203: C154.1 38.13,69.78 37.73,69.39 IC21.8 35.96,69.39 35.65,69.09 35.65,68.33 35.89,68.09 IC21.6 37.92,68.09 38.13,67.88 C155.1
  Top 0.254: TP63.TP 22.38,12.64 D32.C
  Top 0.305: R20.6 140.9,80.56 140.3,81.15 v140.18,81.15 | R3.1 80.09,78.48 v80.61,78.99
  Top 0.356: C28.1 112.83,86.91 112.44,87.3 IC9.5 | 37.77,40.94 37.58,41.13 | R189.2 37.7,65.42 37.33,65.05 37.33,63.25 36.59,62.51 36.59,61.47 v37.89,61.47 | 32.77,42.68 32.51,42.68
  Top 0.406: C27.1 106,94.02 v105.3,94.72 106.8,94.72 107.18,94.34 108.26,94.34 D2.A | v115.16,86.87 113.55,86.87 C28.1
  Top 0.457: C154.1 38.52,70.46 38.37,70.61 37.76,70.61 37.51,70.86 C153.1
  Top 0.508: C155.1 R189.2 | Q2.4 75.65,74.94 75.28,75.31 C11.1
  Top 0.61: C153.1 C152.1 | C11.1 71.46,75.31 70.81,74.65 v70.81,72.24
  Top 1: Q17.5 49.23,32.2 R168.1 48.9,34.04 v47.88,32.89
  Top 1.016: 17.98,12.93 D32.C
  Top 1.2: R48.2 42.48,58.56 v43.81,59.89
  Top 1.27: 17.98,12.93 F3.2 | v86.74,12.83 86.74,16.24 86.58,16.39 86.58,16.41 85.09,17.91 80.9,17.91 79.38,19.43 v78.74,19.43 | 32.77,42.68 C135.1 36.03,42.68 37.58,41.13 | 32.51,42.68 31.61,42.68 v31.26,43.03 | 37.77,40.94 R156.2 39.41,40.89 40.64,40.89 41.01,40.53 Q15.3
  Top 2.286: D32.C 18.27,18.95 C187.+
  SUPPLY 0.356: v80.61,78.99 76.8,75.18 70.81,75.18 | v140.18,81.15 124.14,81.15 122.43,82.87 122.43,91.89 120.9,93.41 117.12,93.41 116.71,93 116.71,88.42 v115.16,86.87
  SUPPLY 0.406: v115.16,86.87 113,86.87 105.3,94.56 v105.3,94.72 98.14,94.72 92.07,88.65 | 92.07,88.65 J9.2 | 92.07,88.65 92.07,82.2 88.87,78.99 v80.61,78.99
  SUPPLY 0.508: J3.13 120.03,3.6 120.03,7.98 | J1.10 120.03,9.57 120.03,7.98 | 120.03,7.98 115.23,7.98 114.85,7.59 101.01,7.59 100.27,8.33 95.83,8.33 94.02,6.53 94.02,3.62 J8.7
  SUPPLY 0.61: v70.81,72.24 70.81,75.18 70.81,86 68.17,88.65 J7.2
  SUPPLY 1.27: 41.19,59.89 39.59,61.49 38.24,61.49 38.22,61.47 v37.89,61.47 | 41.19,59.89 41.19,54.56 35.5,48.87 35.5,47.27 v31.26,43.03 31.26,19.85 31.54,20.13 78.04,20.13 v78.74,19.43 | 95.83,8.33 88.66,8.33 86.74,10.25 v86.74,12.83 | 41.19,59.89 v43.81,59.89 52.01,59.89 53.66,61.54 68.44,61.54 70.81,63.91 v70.81,72.24
  SUPPLY 2: 31.26,19.85 C187.+
  Bottom 0.406: v31.26,43.03 31.08,43.03
  Bottom 1: v47.88,32.89 40.64,32.89 39.5,34.04 39.5,38.34 36.4,41.44 32.84,41.44 v31.26,43.03
  pour Top (isolate 0.305): 11.05,14.99 11.05,11.81 12.19,10.67 19.94,10.67 20.45,11.18 20.45,17.65 21.72,18.92 21.72,21.21 20.7,22.23 17.91,22.23 16.64,20.95 16.64,20.57
+SMB_PRE
  Top 2: JP5.P2 6.28,7.81 J45.4
  pour Top (isolate 0.305, rank 2): 8.26,3.05 10.66,3.05 11.2,4.36 10.75,6.55 7.2,10.03 2.16,10.03 2.16,5.59 5.59,5.59
  pour Top (isolate 0.305, rank 2): 12.06,2.03 12.06,6.48 16.26,6.48 16.26,8.51 9.53,8.51 9.4,2.03
/3.3V1_ON  (via drill 0.3)
  Top 0.152: IC3.95 116.1,25.18 v115.33,24.41 | v103.67,22.71 98.52,22.73 98.39,22.61 97.73,22.61 97.63,22.71 94.63,22.71 94.15,23.19 94.15,24.33 94.42,24.6 Q7.2
  Bottom 0.152: v103.67,22.71 103.77,22.71 104.55,23.49 105.88,23.49 105.89,23.5 106.27,23.5 106.52,23.75 113.57,23.75 113.92,24.1 115.03,24.1 v115.33,24.41
/3.3V2_ON  (via drill 0.3)
  Top 0.152: IC3.94 115.7,25.28 115.41,24.99 115.09,24.99 114.75,24.64 114.75,24.13 114.77,24.1 114.79,24.1 115.19,23.7 115.19,23.05 114.75,22.61 114.75,21.69 113.89,20.83 v111.73,20.83 | v102.33,23.37 102.33,25.53 101.44,26.42 100.81,26.42 99.92,25.53 98.77,25.53 98.52,25.27 98.52,24.77 98.35,24.6 Q7.5
  Bottom 0.152: v102.33,23.37 102.33,22.86 103.09,22.1 110.46,22.1 v111.73,20.83
/CL_CS1  (via drill 0.3)
  Top 0.152: IC3.1 120.98,29.1 121.38,28.7 121.38,28.32 123.41,26.29 v123.41,18.41 | J3.19 128.92,3.42 127.89,4.44 127.89,12.66 v124.55,16
  Bottom 0.152: v123.41,18.41 124.55,17.27 v124.55,16
/CL_CS2  (via drill 0.3)
  Top 0.152: J1.7 118.31,12.11 118.31,13.06 v119.47,14.22 | IC3.17 118.02,35.5 v117.95,35.43 | v121.76,22.86 121.45,22.55 121.45,22.49 121.18,22.21 121.18,18.99 119.47,17.29 v119.47,16.76
  Bottom 0.152: v117.95,35.43 117.95,34.1 118.53,33.52 118.53,33.03 118.25,32.76 118.25,30.58 118.38,30.45 118.38,25.27 119.96,23.7 120.92,23.7 v121.76,22.86 | v119.47,16.76 v119.47,14.22
/CTS
  Top 0.152: IC18.11 130.62,94.11 130.23,94.5 J41.2
/FMEM1_CS  (via drill 0.3)
  Top 0.152: R24.2 118.34,59.6 118.13,59.38 118.13,58.12 118.34,57.91 IC8.1
  Top 0.203: IC3.28 117.3,39.61 117.72,39.19 118.41,39.19 118.61,39.4 118.61,40.63 v118.87,40.89 | IC8.1 121.87,57.91 122.7,57.07 122.7,53.26 123.69,52.27 123.69,47.36 v122.05,45.72
  SUPPLY 0.203: v118.87,40.89 118.87,42.93 121.67,45.72 v122.05,45.72
/MCLR  (via drill 0.3)
  Top 0.152: J11.1 112.12,52.01 R14.1 | v116.68,33.88 116.7,33.9 IC3.13 122.68,33.9 122.8,33.78 127.22,33.78 127.6,33.4 128.24,33.4 v129.51,32.13 | IC4.4 138.05,7.78 137.89,7.62 137.51,7.62 137.13,8 v137.13,17.4
  Bottom 0.152: J11.1 112.12,46.47 109.9,44.25 108.32,44.25 107.87,43.79 107.87,42.9 109.72,41.04 109.72,36.55 112.39,33.88 v116.68,33.88 | v137.13,17.4 129.18,25.35 129.18,31.5 129.51,31.83 v129.51,32.13
/MCLR2  (via drill 0.3)
  Top 0.152: IC4.6 139.95,7.91 140.37,7.49 v141.13,7.49
  Bottom 0.152: v141.13,7.49 142.46,6.16 144.18,6.16 145,5.33 145,2.79 145.83,1.97 152.81,1.97 153.4,2.56 J12.1
/RAM_CS  (via drill 0.3)
  Top 0.152: IC3.3 119.85,29.85 119,29.85 118.87,29.71 118.87,28.89 119,28.75 120.31,28.75 121,28.07 121.2,28.07 123.11,26.16 123.11,19.38 v122.78,19.05
  Bottom 0.152: J8.13 100.35,3.42 101.38,4.44 101.38,6.54 109.44,14.61 111.28,14.61 111.36,14.53 112.35,14.53 113.71,15.89 113.71,16.58 116.35,19.23 122.6,19.23 v122.78,19.05
/RTS
  Top 0.152: IC18.3 135.82,92.49 136.31,92.99 137.31,92.99 140.39,96.08 J41.6
/SM_FAULT  (via drill 0.3)
  Top 0.152: IC3.21 123.55,37.1 v124.17,37.72 | U1.24 104.91,17.95 105.12,18.16 105.12,18.8 105,18.92 v104.49,18.92
  SUPPLY 0.152: v124.17,37.72 127.6,37.72 128.75,36.58 128.75,26.92 130.27,25.4 130.27,23.24 129.51,22.48 126.59,22.48 125.04,24.03 119.65,24.03 118.33,25.35 115.41,25.35 115.08,25.02 112.36,25.02 110.08,22.73 110.08,21.08 v109.82,20.83
  Bottom 0.152: v109.82,20.83 107.92,18.92 v104.49,18.92
/XB_RESET
  Top 0.152: IC3.18 121.57,35.9 121.66,35.99 125.96,35.99 126.04,35.92 126.52,35.92 126.86,36.26 126.86,36.7 131.1,40.94 J2.6
A1
  Top 0.152: L2.2 85.46,80.67 85.95,81.15 87.22,81.15 87.64,81.57 J9.3 87.64,89.62 86.71,90.55 65.5,90.55 64.64,89.69 J7.3
A+  (via drill 0.3)
  Top 0.203: Q3.3 92.44,72.92 92.17,72.64 85.69,72.64 84.94,73.39 R11.1 84.93,74.32 84.93,75.18 85.46,75.71 L2.1 v87.09,76.58 | IC2.6 93.58,75.81 93.31,76.07 93.31,76.83 92.88,77.27 R9.1 92.17,77.39 v92.17,78.49
  Bottom 0.203: v87.09,76.58 88.99,78.49 v92.17,78.49
ACT_S1_B  (via drill 0.3)
  Top 0.152: IC3.52 104.19,38.3 v103.45,39.04 | v59.23,23.29 58,23.29 R183.1
  Top 0.8: R183.1 55.99,23.3 54.38,24.92 Q20.1
  Bottom 0.203: v103.45,39.04 102.66,39.04 101.82,39.88 92.3,39.88 90.9,38.48 90.9,35.69 78.15,22.94 60.34,22.94 59.99,23.29 v59.23,23.29
ACT_S2_B  (via drill 0.3)
  Top 0.152: IC3.53 103.42,37.9 102.33,38.99 102.33,40.26 101.57,41.02 v100.93,41.02 | v68.55,23.88 69.18,23.88 69.94,23.11 69.94,21.55 R184.1
  Top 0.762: Q21.1 67.81,21.48 R184.1
  Bottom 0.152: v100.93,41.02 91.53,41.02 89.88,39.37 89.88,35.81 85.82,31.75 84.74,31.75 84.54,31.55 83.05,31.55 82.52,32.08 82.08,32.08 81.58,31.57 80.22,31.57 79.88,31.23 79.88,30.75 80.1,30.52 80.1,26.04 77.33,23.27 69.16,23.27 v68.55,23.88
AGND  (via drill 0.3)
  Top 0.152: U8.EP 46.98,91.77 v46.88,91.67
  Top 0.203: 53,80.14 53.23,80.37 v53.23,80.39 | C172.2 v49.95,83.82 | U8.24 46.92,92.16 46.93,92.15 47.31,92.15 | 47.31,92.15 48.17,92.15 U8.EP | U8.19 50.17,92.19 50.13,92.15 48.93,92.15 U8.EP | U8.8 48.88,91.44 U8.EP | U8.4 46.27,91.11 46.66,91.5 | 46.66,91.5 47.31,92.15 | U8.3 45.62,91.38 46.12,91.87 46.3,91.87 46.66,91.5 | U9.2 23.58,75.88 23.03,75.34 v21.73,75.31 | R210.2 18.81,69.93 v17.54,69.93 | R211.2 20.52,72.33 v20.52,71.14 | C180.2 36.89,80.92 v38.32,82.35 | Q24.2 v24.25,68.05
  Top 0.508: C171.2 53.21,80.34 53,80.14 50.53,80.14 R203.2 R202.2 | L17.2 v54.4,78.94 v54.4,79.78 | C167.2 v53.05,99.62 | C168.2 v42.55,99.91 v42.56,99.92
  Top 0.762: C179.2 C176.2 35.83,90.55 v36.26,90.12 36.61,89.78 C181.2 36.61,86.8 36.12,86.32 C177.1 36.22,85.62 C182.2 | C170.2 C167.2 | C169.2 C168.2
  DGND 0.508: v54.4,78.94 v54.4,79.78
  other vias: 49.09,91.67 47.72,91.69 50.03,91.69 34.69,91.67 25.88,81.41 25.88,84.58 25.88,86.49 25.88,79.5
  pour DGND (isolate 0.305, rank 2): 1,102.1 55.67,102.1 55.67,75.44 51.91,75.44 51.91,78.74 35.91,78.74 35.91,75.44 26,75.44 26,67.04 1,67.04
  pour Top: 26.28,77.12 29.78,77.12 30.48,77.82 30.48,87.32 29.98,87.82 26.18,87.82 25.58,87.22 25.58,77.82
AUD_AMP_FAULT#
  Top 0.203: 44.98,87.83 U8.2 | 44.98,87.83 44.98,86.84 R205.1 R204.1 | U8.1 44.33,87.95 44.44,87.83 44.98,87.83
AUD_AMP_G0  (via drill 0.3)
  Top 0.152: v112.03,73.41 112.03,72.57 111.47,72.01 111.47,68.71 113.07,67.11 113.07,65.79 111.57,64.29 111.24,64.29 110.46,63.5 110.46,59.84 108.15,57.53 108.15,55.58 108.28,55.45 108.97,55.45 109.59,54.82 109.59,49.89 TP4.P$1 113,45.66 112.74,45.4 112.36,45.4 112.1,45.14 IC3.41 | R200.2 46.8,81.66 46.55,81.41 46.14,81.41 45.94,81.2 45.94,79.35 46.45,78.84 52.39,78.84 52.7,78.54 52.7,76.05 53.18,75.56 57.75,75.56 58.13,75.18 62.7,75.18 64.1,73.79 66.01,73.79 67.15,72.64 67.15,71.5 68.29,70.36 77.03,70.36 v78.83,72.16
  Top 0.203: U8.5 46.92,82.5 R200.2 R202.1
  Bottom 0.152: v112.03,73.41 111.75,73.12 111.75,73.11 111.41,72.77 110.93,72.77 110.55,73.15 94.89,73.15 93.23,71.5 89.91,71.5 89.58,71.83 86.12,71.83 85.9,72.06 78.94,72.06 v78.83,72.16
AUD_AMP_G1  (via drill 0.3)
  Top 0.152: R203.1 48.8,79.36 49.01,79.15 52.72,79.15 53,78.87 53,76.17 53.31,75.87 57.95,75.87 58.34,75.49 62.83,75.49 64.23,74.09 66.13,74.09 67.49,72.73 67.49,71.59 68.42,70.66 76.51,70.66 78.59,72.74 78.86,72.74 78.86,72.75 v79.47,72.75 | v111.17,73.36 111.17,68.58 112.77,66.98 112.77,65.91 111.45,64.59 111.12,64.59 110.15,63.63 110.15,59.97 107.84,57.66 107.84,55.42 108.12,55.14 108.84,55.14 109.19,54.8 109.19,48.83 TP5.P$1 111.54,45.4 111.7,45.24 IC3.42
  Top 0.203: U8.6 47.58,88.02 47.28,87.72 47.28,83.98 v47.77,83.49 | v47.8,81.25 47.16,81.25 46.85,80.95 46.85,80.22 R201.2 R203.1
  Bottom 0.152: v111.17,73.36 111.07,73.46 94.76,73.46 93.11,71.81 90.03,71.81 89.7,72.14 86.25,72.14 86.02,72.36 79.85,72.36 v79.47,72.75
  Bottom 0.203: v47.77,83.49 47.77,81.28 v47.8,81.25
AUD_AMP_INN  (via drill 0.3)
  Top 0.203: U8.11 50.83,87.64 v50.79,87.61 | v34.97,83.82 C177.2
  Bottom 0.203: v50.79,87.61 38.75,87.61 v34.97,83.82
AUD_AMP_INP  (via drill 0.3)
  Top 0.203: U8.12 51.48,87.09 v51.1,86.72 | v16.73,78.51 16.68,78.57 C175.2
  Top 0.508: C175.2 C174.2
  SUPPLY 0.203: v51.1,86.72 41.65,86.72 37.53,82.6 30.3,82.6 25.16,77.47 25.16,72.9 24.81,72.55 24.3,72.55 23.95,72.9 23.95,74.85 22.19,76.61 21.18,76.61 19.27,78.51 v16.73,78.51
AUD_AMP_SD#
  Top 0.965: R204.2 42.95,83.65 42.65,83.35 TP69.1
AUD_BSN
  Top 0.203: U8.22 48.23,96.47 47.8,96.89 C178.1 47.85,98.61 47.85,99.34 47.64,99.54 45.46,99.54 45.2,99.29 45.2,97.87 45.62,97.45 U8.26
AUD_BSP
  Top 0.203: U8.17 51.48,98.43 C173.1 51.35,98.59 51.35,99.39 51.12,99.62 48.96,99.62 48.73,99.39 48.73,97.66 48.88,97.52 U8.21
AUD_GVDD
  Top 0.203: 50.17,87.78 U8.10 | 50.17,87.78 50.17,87.39 49.95,87.17 C172.1 | U8.9 49.52,87.88 49.62,87.78 50.17,87.78
B1
  Top 0.152: L1.2 82.53,80.79 83.28,81.53 85.82,81.53 86.36,82.08 J9.4
  Bottom 0.152: J9.4 83.96,91.06 64.99,91.06 63.37,89.43 J7.4
B12_BOOT  (via drill 0.3)
  Top 0.203: v59.91,50.32 59.91,49.37 C126.1 | U6.11 60.27,54.63 60.27,54.67 59.94,54.99 59.94,56.26 v59.68,56.52
  SUPPLY 0.203: v59.68,56.52 59.68,50.55 v59.91,50.32
B12_COMP  (via drill 0.3)
  Top 0.203: R164.2 65.04,52.19 65.88,53.03 v66.41,53.03 | v66.16,56.44 66.16,56.08 66.03,55.95 66.03,55.37 65.8,55.14 U6.3
  Top 0.508: C131.1 R164.2
  SUPPLY 0.203: v66.41,53.03 66.16,53.29 v66.16,56.44
B12_FB  (via drill 0.3)
  Top 0.203: U6.4 65.52,55.64 65.65,55.78 65.65,56.09 65.55,56.19 65.55,56.69 65.91,57.05 67.61,57.05 68.22,57.66 v68.83,57.66 | v80.08,64.01 80.14,64.07 R160.1
  Top 0.508: R166.2 83.84,66.04 83.58,66.29 80.41,66.29 80.28,66.17 80.28,65.55 R160.1
  Bottom 0.203: v68.83,57.66 73.25,62.08 73.25,63.17 73.75,63.68 74.9,63.68 75.23,64.01 v80.08,64.01
B12_FEED
  Top 0.508: 65.77,60.69 66.29,60.17 67.25,60.17 R158.2
  Top 0.762: L11.2 88.3,56.83 86.96,58.17 72.81,58.17 70.84,60.14 R158.2
  Top 0.8: R43.2 R42.2 64.78,61.58 66.22,60.14 R158.2
B12_HDRV  (via drill 0.3)
  Top 0.203: U6.13 62.74,52.71 v62.43,52.4 | v74.08,63.02 74.15,63.08 R161.2
  SUPPLY 0.203: v62.43,52.4 69.92,52.4 70.45,52.93 70.45,59.38 v74.08,63.02
B12_HG
  Top 0.356: Q16.3 79.55,61.38 78.83,62.1 78.2,62.1 77.94,62.36 R161.1
B12_ISNS+
  Top 0.203: U6.6 63.74,56.88 63.14,57.48 C124.1
  Top 0.508: R157.1 63.09,58.34 C124.1
B12_ISNS-
  Top 0.203: U6.5 64.24,56.9 64.84,57.5 C124.2
  Top 0.508: C124.2 67.24,58.39 R158.1
B12_L
  Top 1.27: D20.A 87.71,68.01 88.16,67.56 88.16,65.09 L11.1
  pour Top: 83.36,61.37 87.85,61.37 89.22,62.48 90.8,62.48 91.13,62.81 91.13,67.31 90.67,67.77 89.6,67.77 88.41,68.96 85.34,68.96 84.6,69.7 82.24,69.7 81.93,69.39 81.93,67.84 84.93,67.84 84.9,66.32 84.9,64.49 84.63,64.21 83.46,64.21 83.33,64.08 83.33,61.39
B12_LDRV  (via drill 0.3)
  Top 0.203: U6.8 62.74,56.87 62.58,57.02 61.82,57.02 v61.69,56.9 | v75.02,60.96 75.04,60.98 R163.2
  SUPPLY 0.203: v61.69,56.9 65.76,56.9 65.91,57.05 66.79,57.05 73.37,63.63 74.77,63.63 75.02,63.37 v75.02,60.96
B12_LG
  Top 0.356: R163.1 77.94,59.95 78.28,59.61 84.35,59.61 84.55,59.82 84.55,60.45 84.27,60.73 Q16.5
B12_PG  (via drill 0.3)
  Top 0.152: IC3.69 104.12,31.5 102.97,30.35 91.02,30.35 89.26,32.11 86.03,32.11 85.17,31.24 83.93,31.24 83.41,31.76 83.41,33.29 84.08,33.96 84.98,33.96 v85.03,34.01 | U6.14 63.24,52.35 62.45,51.56 R167.1 63,50.89 63.47,50.42 63.47,47.88 v63.85,47.5
  Bottom 0.152: v85.03,34.01 79.72,39.32 78.96,39.32 77.21,41.07 74.9,41.07 68.39,47.57 63.9,47.57 63.85,47.52 v63.85,47.5
B12_RC
  Top 0.61: R164.1 67.67,51.29 67.82,51.14 C133.1
B12_RT
  Top 0.203: U6.1 67.29,54.14 R165.2
B12_SS
  Top 0.203: U6.2 66.01,54.64 66.39,55.02 66.39,55.8 66.68,56.09 C132.1
B12_SW  (via drill 0.3)
  Top 0.203: U6.12 61.5,54.14 61.38,54.03 61.38,53.06 61.46,52.98 61.46,47.6 v61.56,47.5 61.4,47.4 C126.2 | Q16.4 79.62,60.73 v79.34,60.45
  Bottom 0.203: v79.34,60.45 75.38,60.45 75.28,60.35 75.05,60.35 62.2,47.5 v61.56,47.5
B12_VCC  (via drill 0.3)
  Top 0.203: U6.10 60.65,55.14 v60.55,55.24 | 60.55,52.63 v60.55,52.65
  Top 0.8: C127.1 60.55,51.71 60.55,52.63
  SUPPLY 0.203: v60.55,55.24 v60.55,52.65
B-
  Top 0.203: L1.1 82.53,77.61 83.03,78.11 86.45,78.11 87.3,77.26 R10.2 88.58,77.27 R9.2 91.41,76.34 91.41,74.78 91.65,74.53 | 91.65,74.53 IC2.7 | 91.65,74.53 91.28,74.17 91.28,73.79 91.03,73.53 90.41,73.53 Q3.2
BAT_GND  (via drill 0.3)
  Top 0.305: U3.7 19.9,42.07 v19.56,42.42
  Top 0.762: R36.1 C41.2 C42.1 R38.1 26.01,40.28 v26.04,40.26
  Bottom 0.305: v19.56,42.42 23.88,42.42 v26.04,40.26
BAT_SENSE
  Top 0.762: JP4.P2 7.64,18.56 8.26,19.18 8.26,23.47 9.93,25.15 9.93,25.91 9.93,30.36 13.84,34.27 17.02,34.27 23.37,34.27 27.05,37.95 27.05,40.89 26.04,41.91 R35.2
  Bottom 2: JP3.P2 2.89,29.3 1.91,28.32 1.91,19.3 2.65,18.56 JP4.P2
BTN_1  (via drill 0.3)
  Top 0.152: v144.68,7.05 144.7,7.07 R2.3 | IC4.1 139.95,12.35 v140.43,12.83
  Top 0.254: R2.2 143.9,7.28 142.94,6.33 141.44,6.33 140.5,5.38 140.5,4 J5.2
  Top 0.356: R2.3 R2.2
  Bottom 0.152: J12.4 148.91,7.05 v144.68,7.05 144.62,7.11 144.62,7.75 143.6,8.76 141.19,8.76 140.43,9.53 v140.43,12.83
BTN_1PIN_B  (via drill 0.3)